# EasyEDA schematic SCH_AidF-Phone-Control-Module.json

## Sheets
1 Power Inlet: TITLE: AidF Phone Module Power and Connectors; REV: 1.0; Date: 2024-09-13; Sheet: 1/1; Drawn By: Aidan C Franits; Company: AidF Electronics
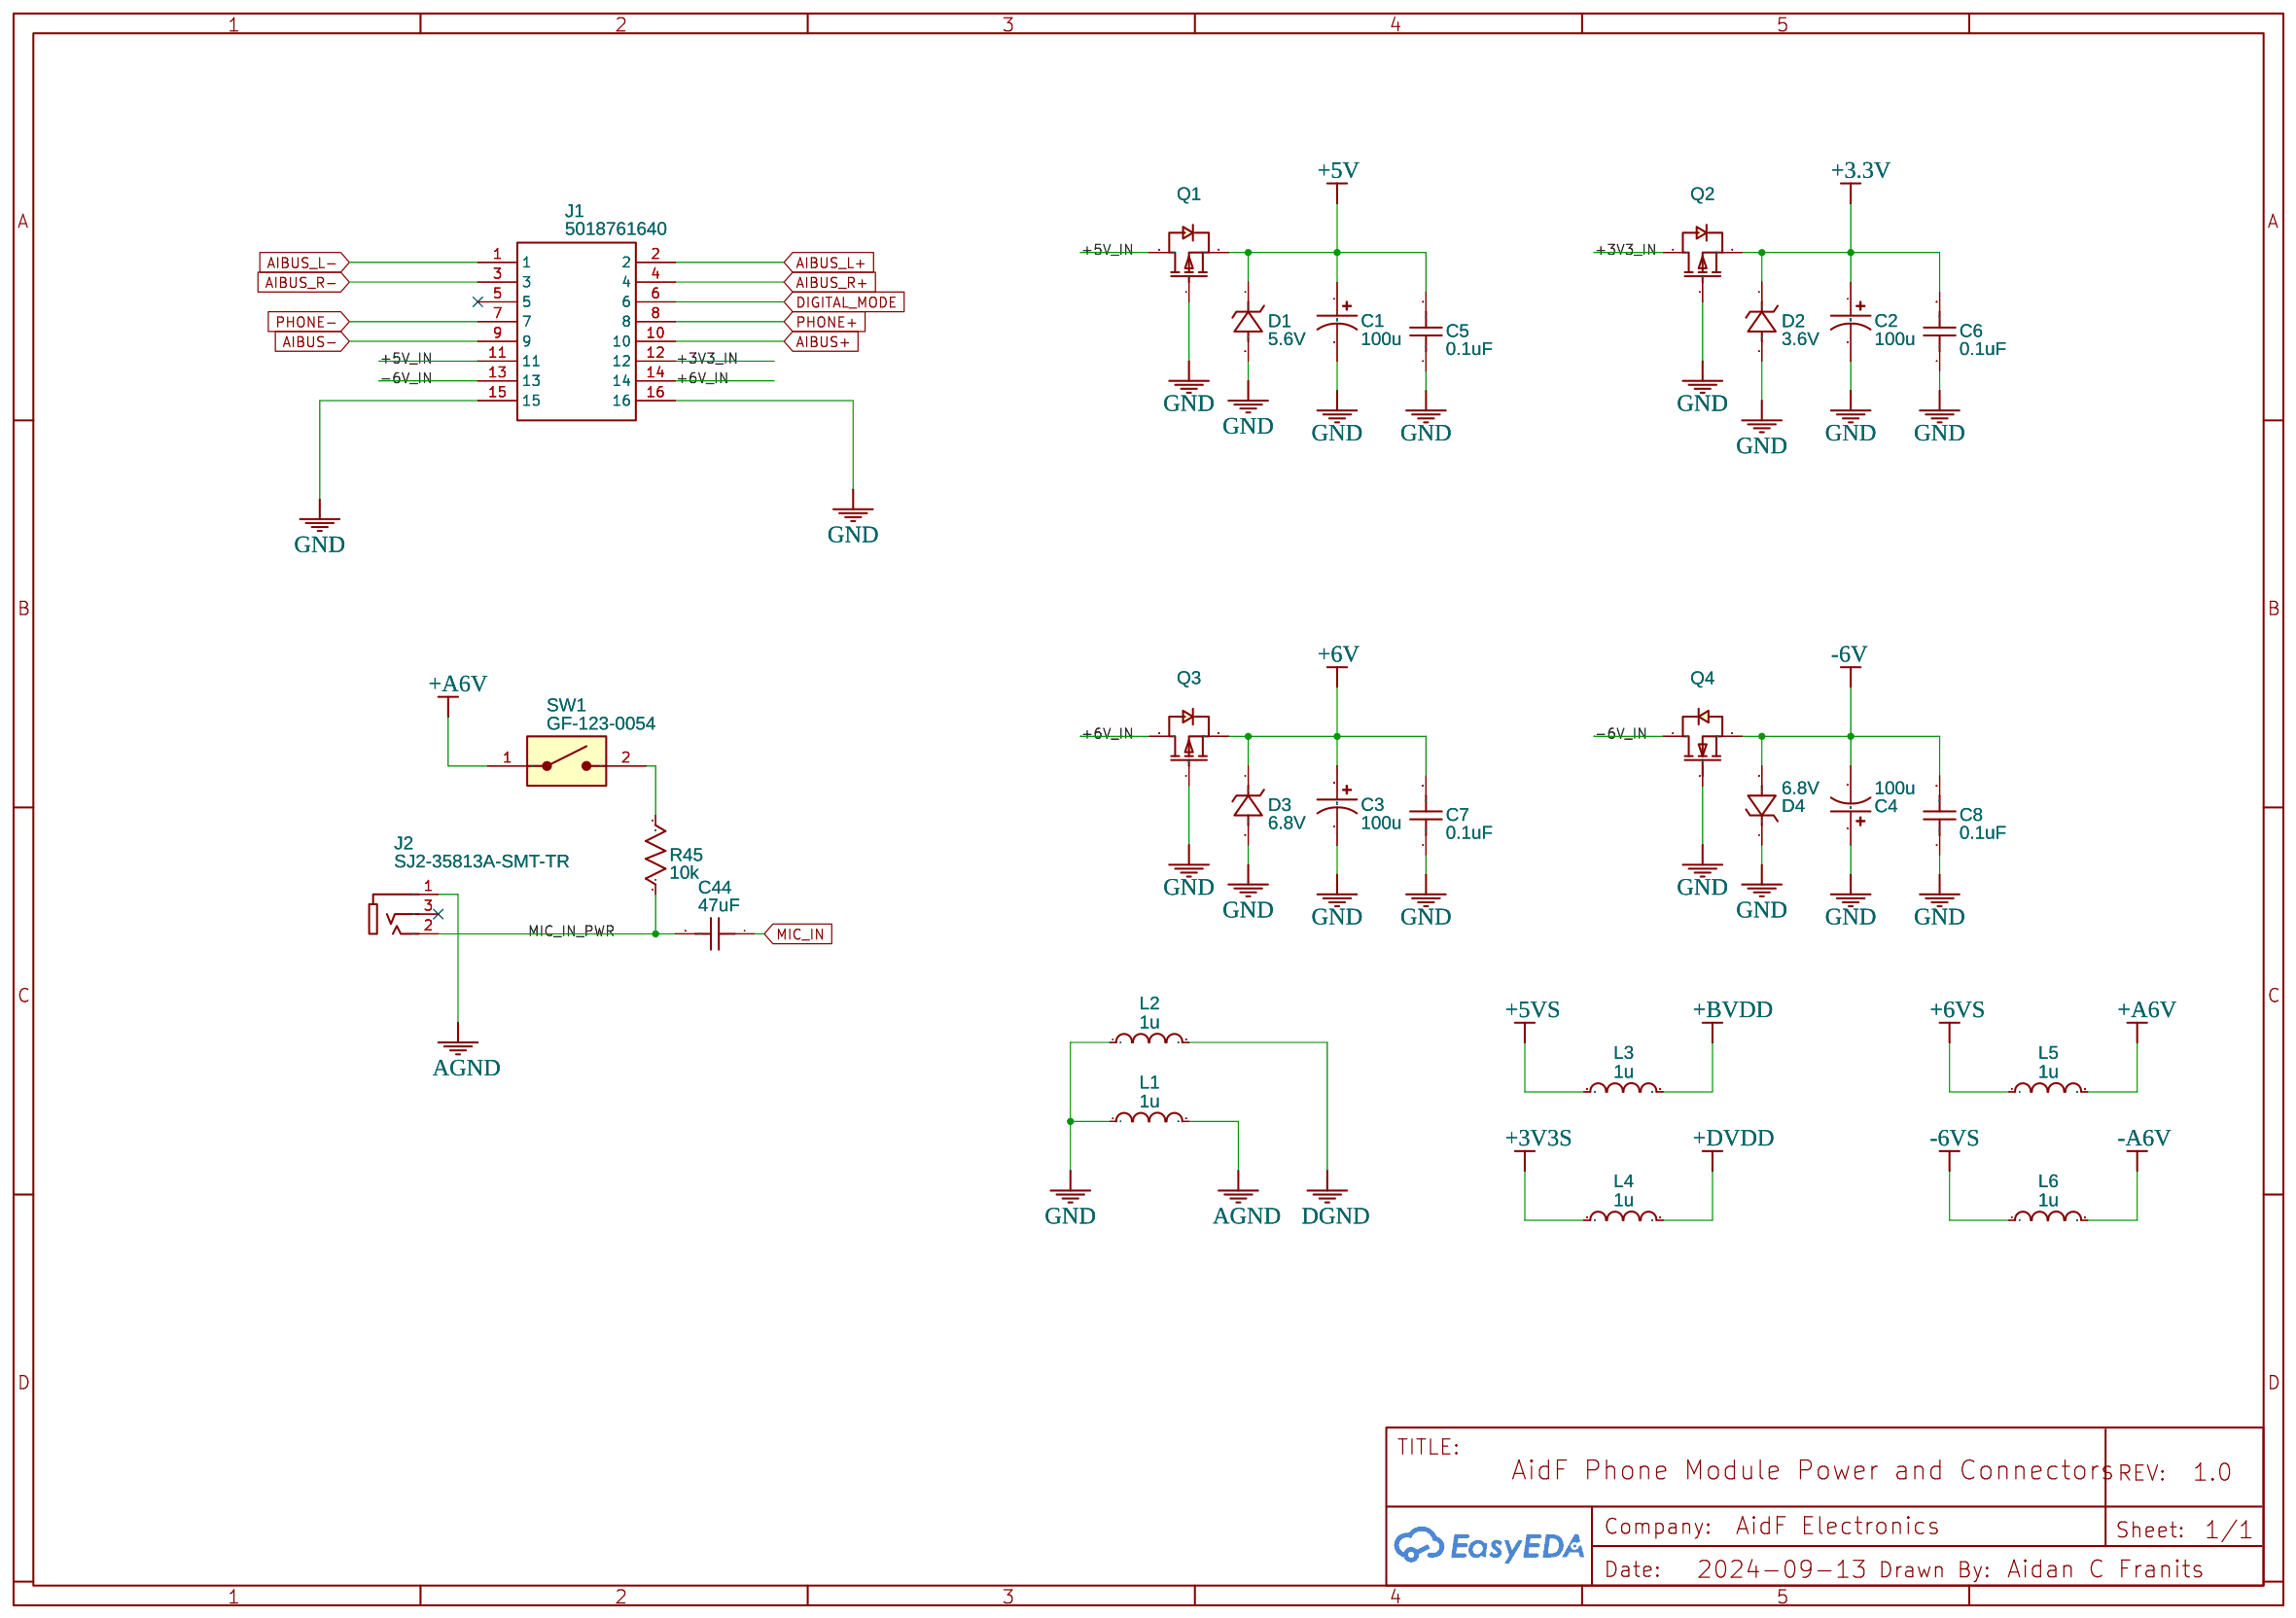
[diagram p0: Power Inlet]
2 Main Controller: TITLE: AidF Phone Control Module MCU; Date: 2024-09-14
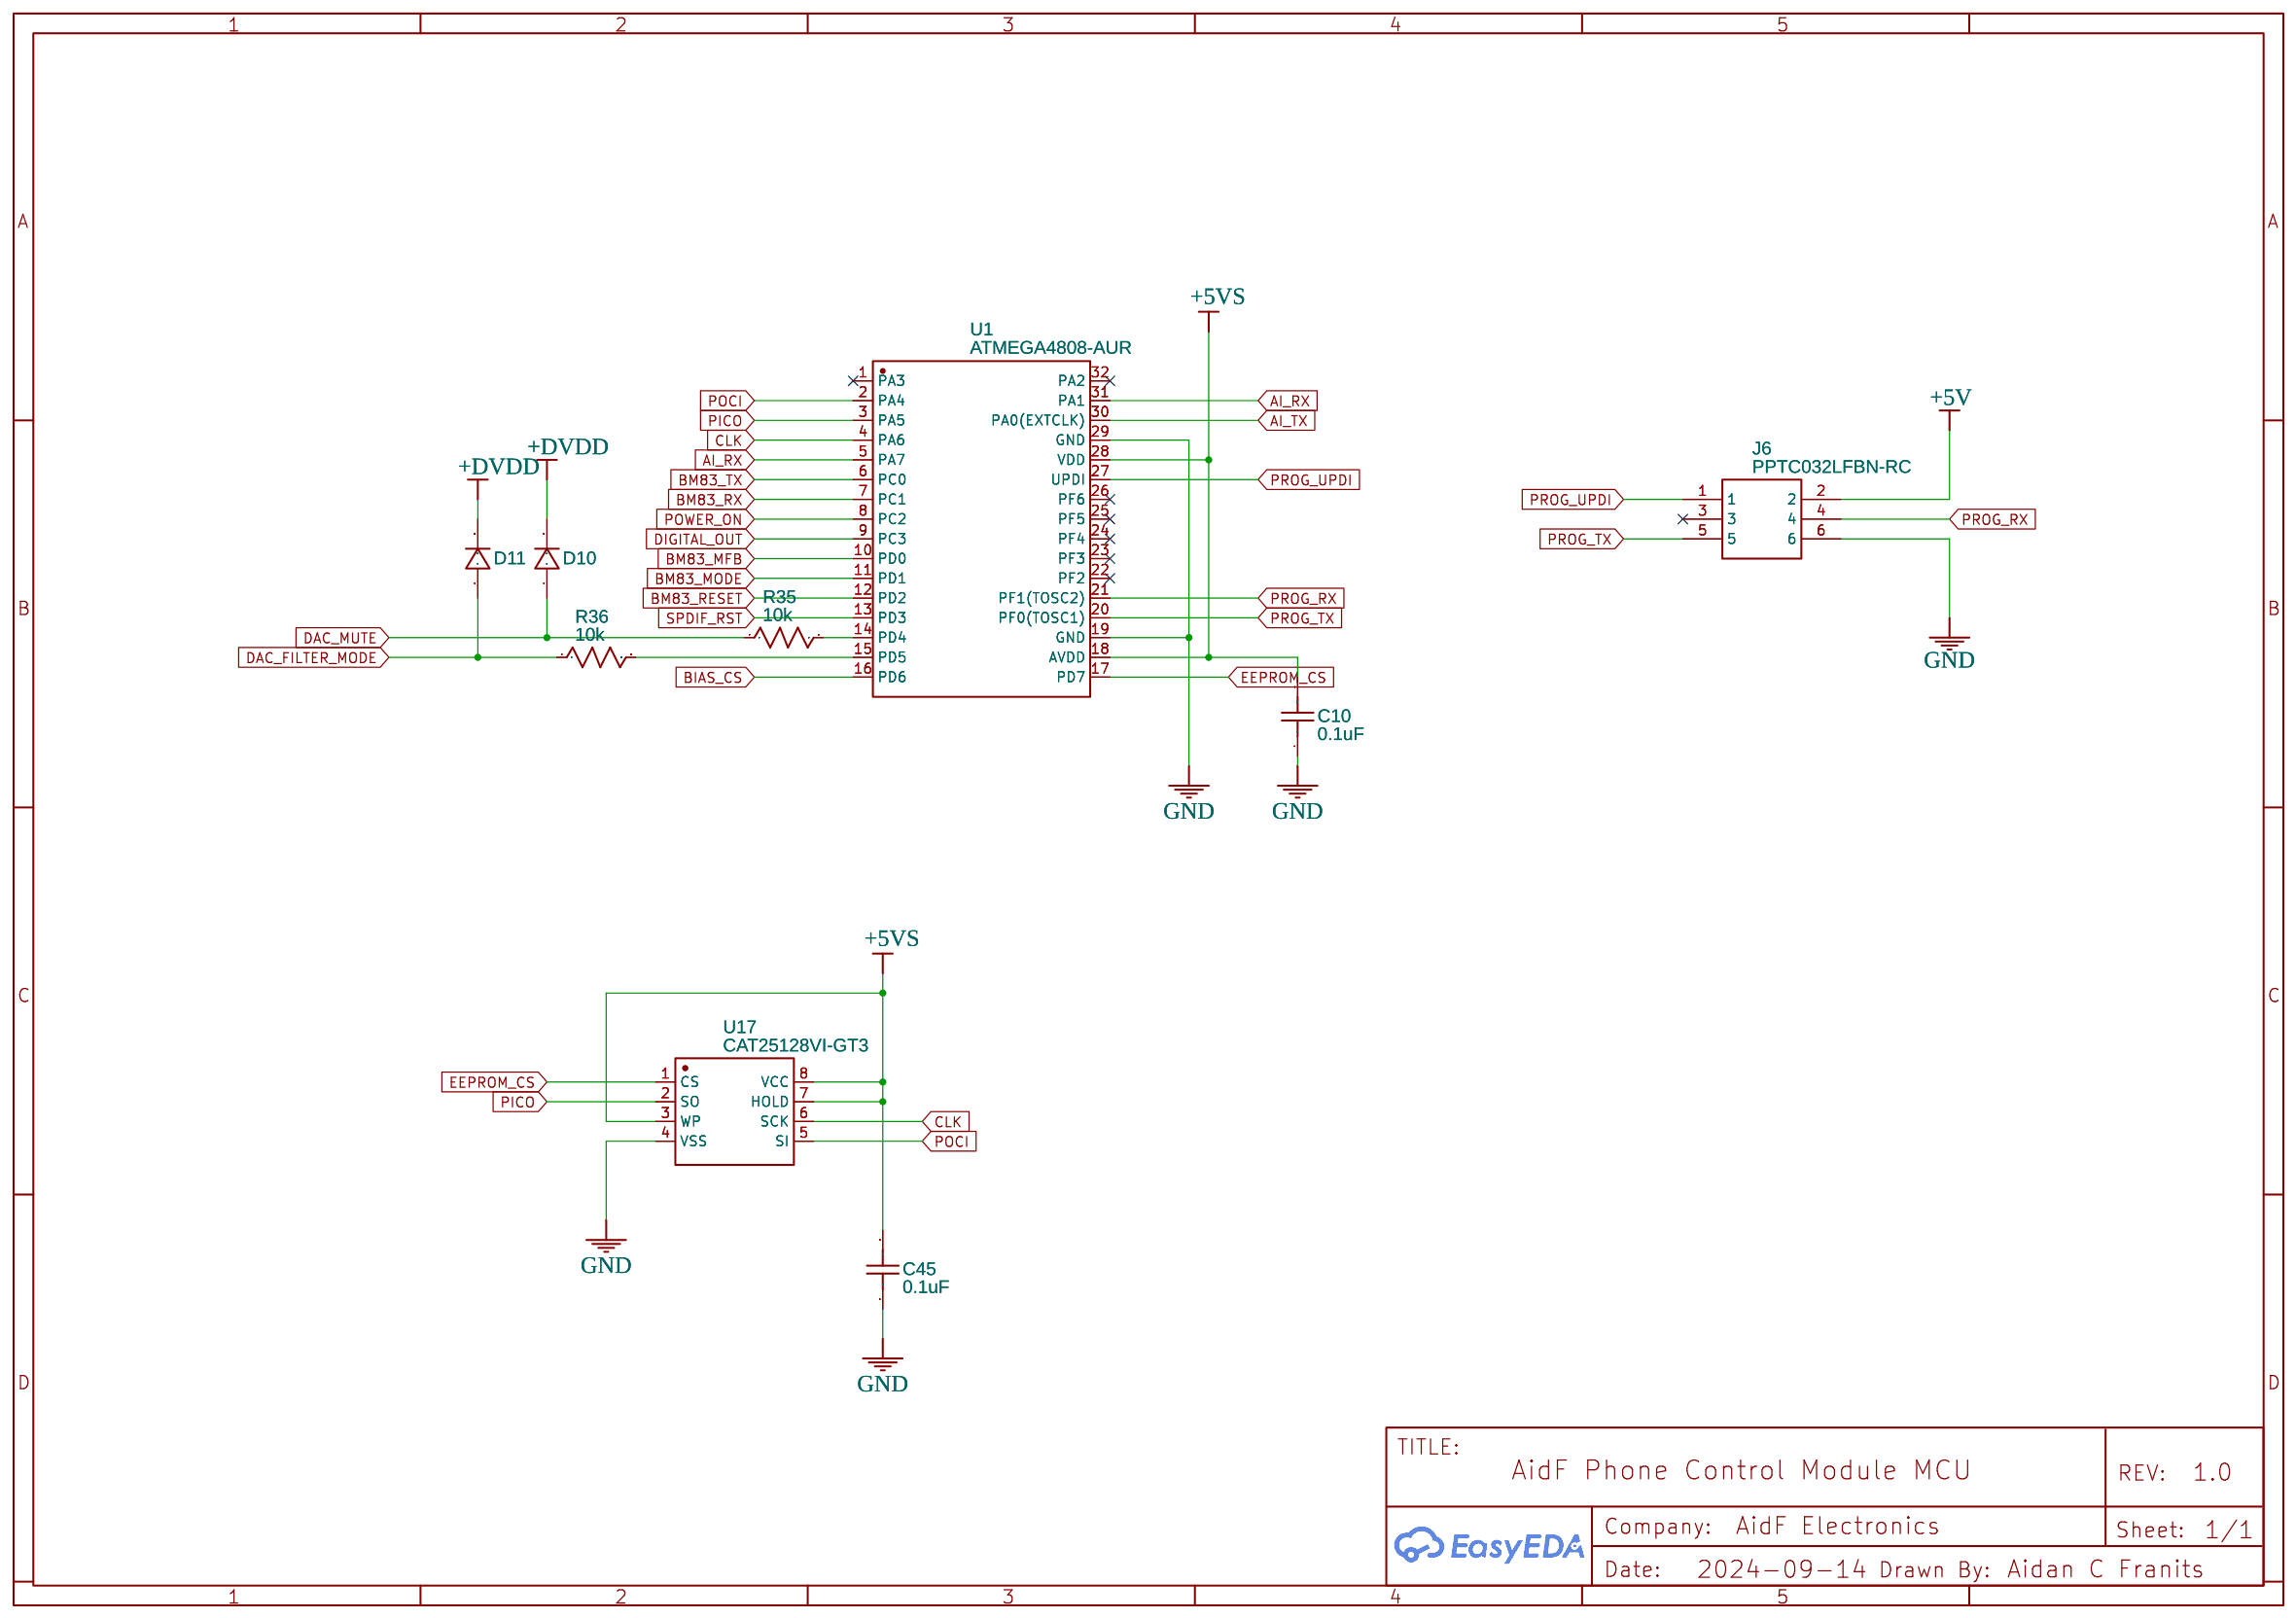
[diagram p1: Main Controller]
3 AIBus Inlet: TITLE: AidF Phone Control Module AIBus Inlet; Date: 2024-09-14
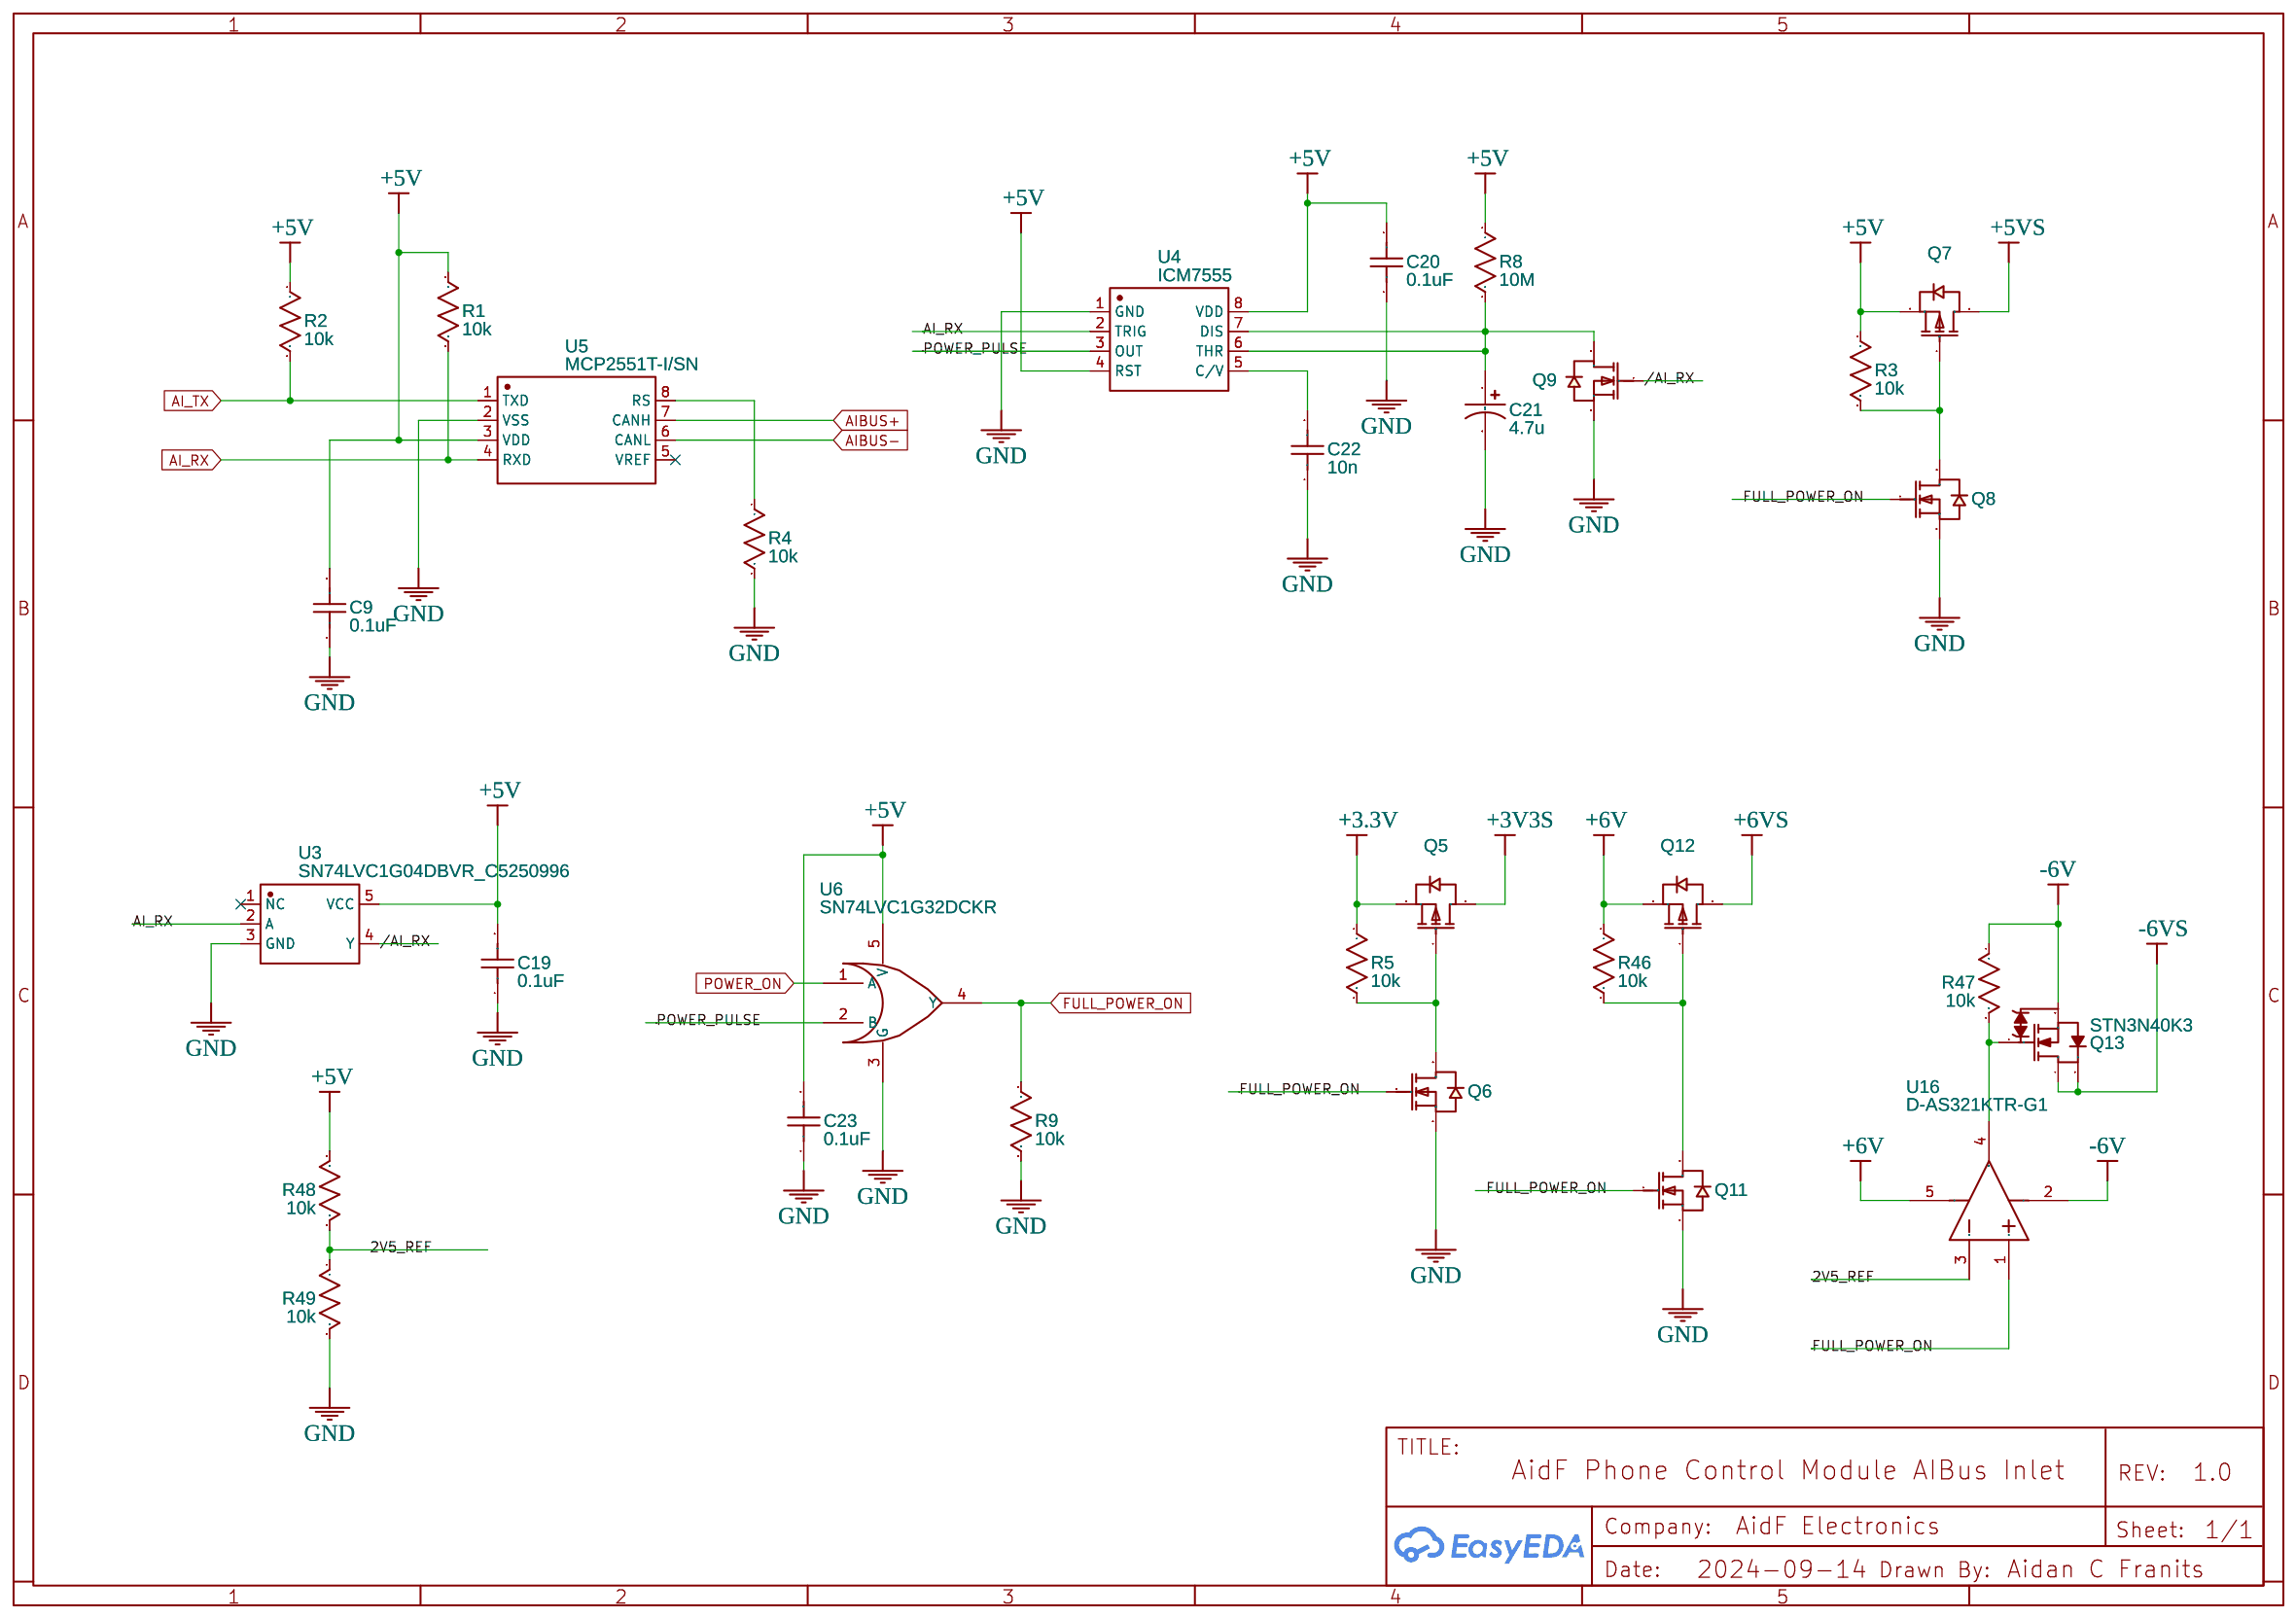
[diagram p2: AIBus Inlet]
4 BM83: TITLE: AidF Phone Control Module BM83; Date: 2024-09-14; Drawn By: A. Franits, T. Salmon
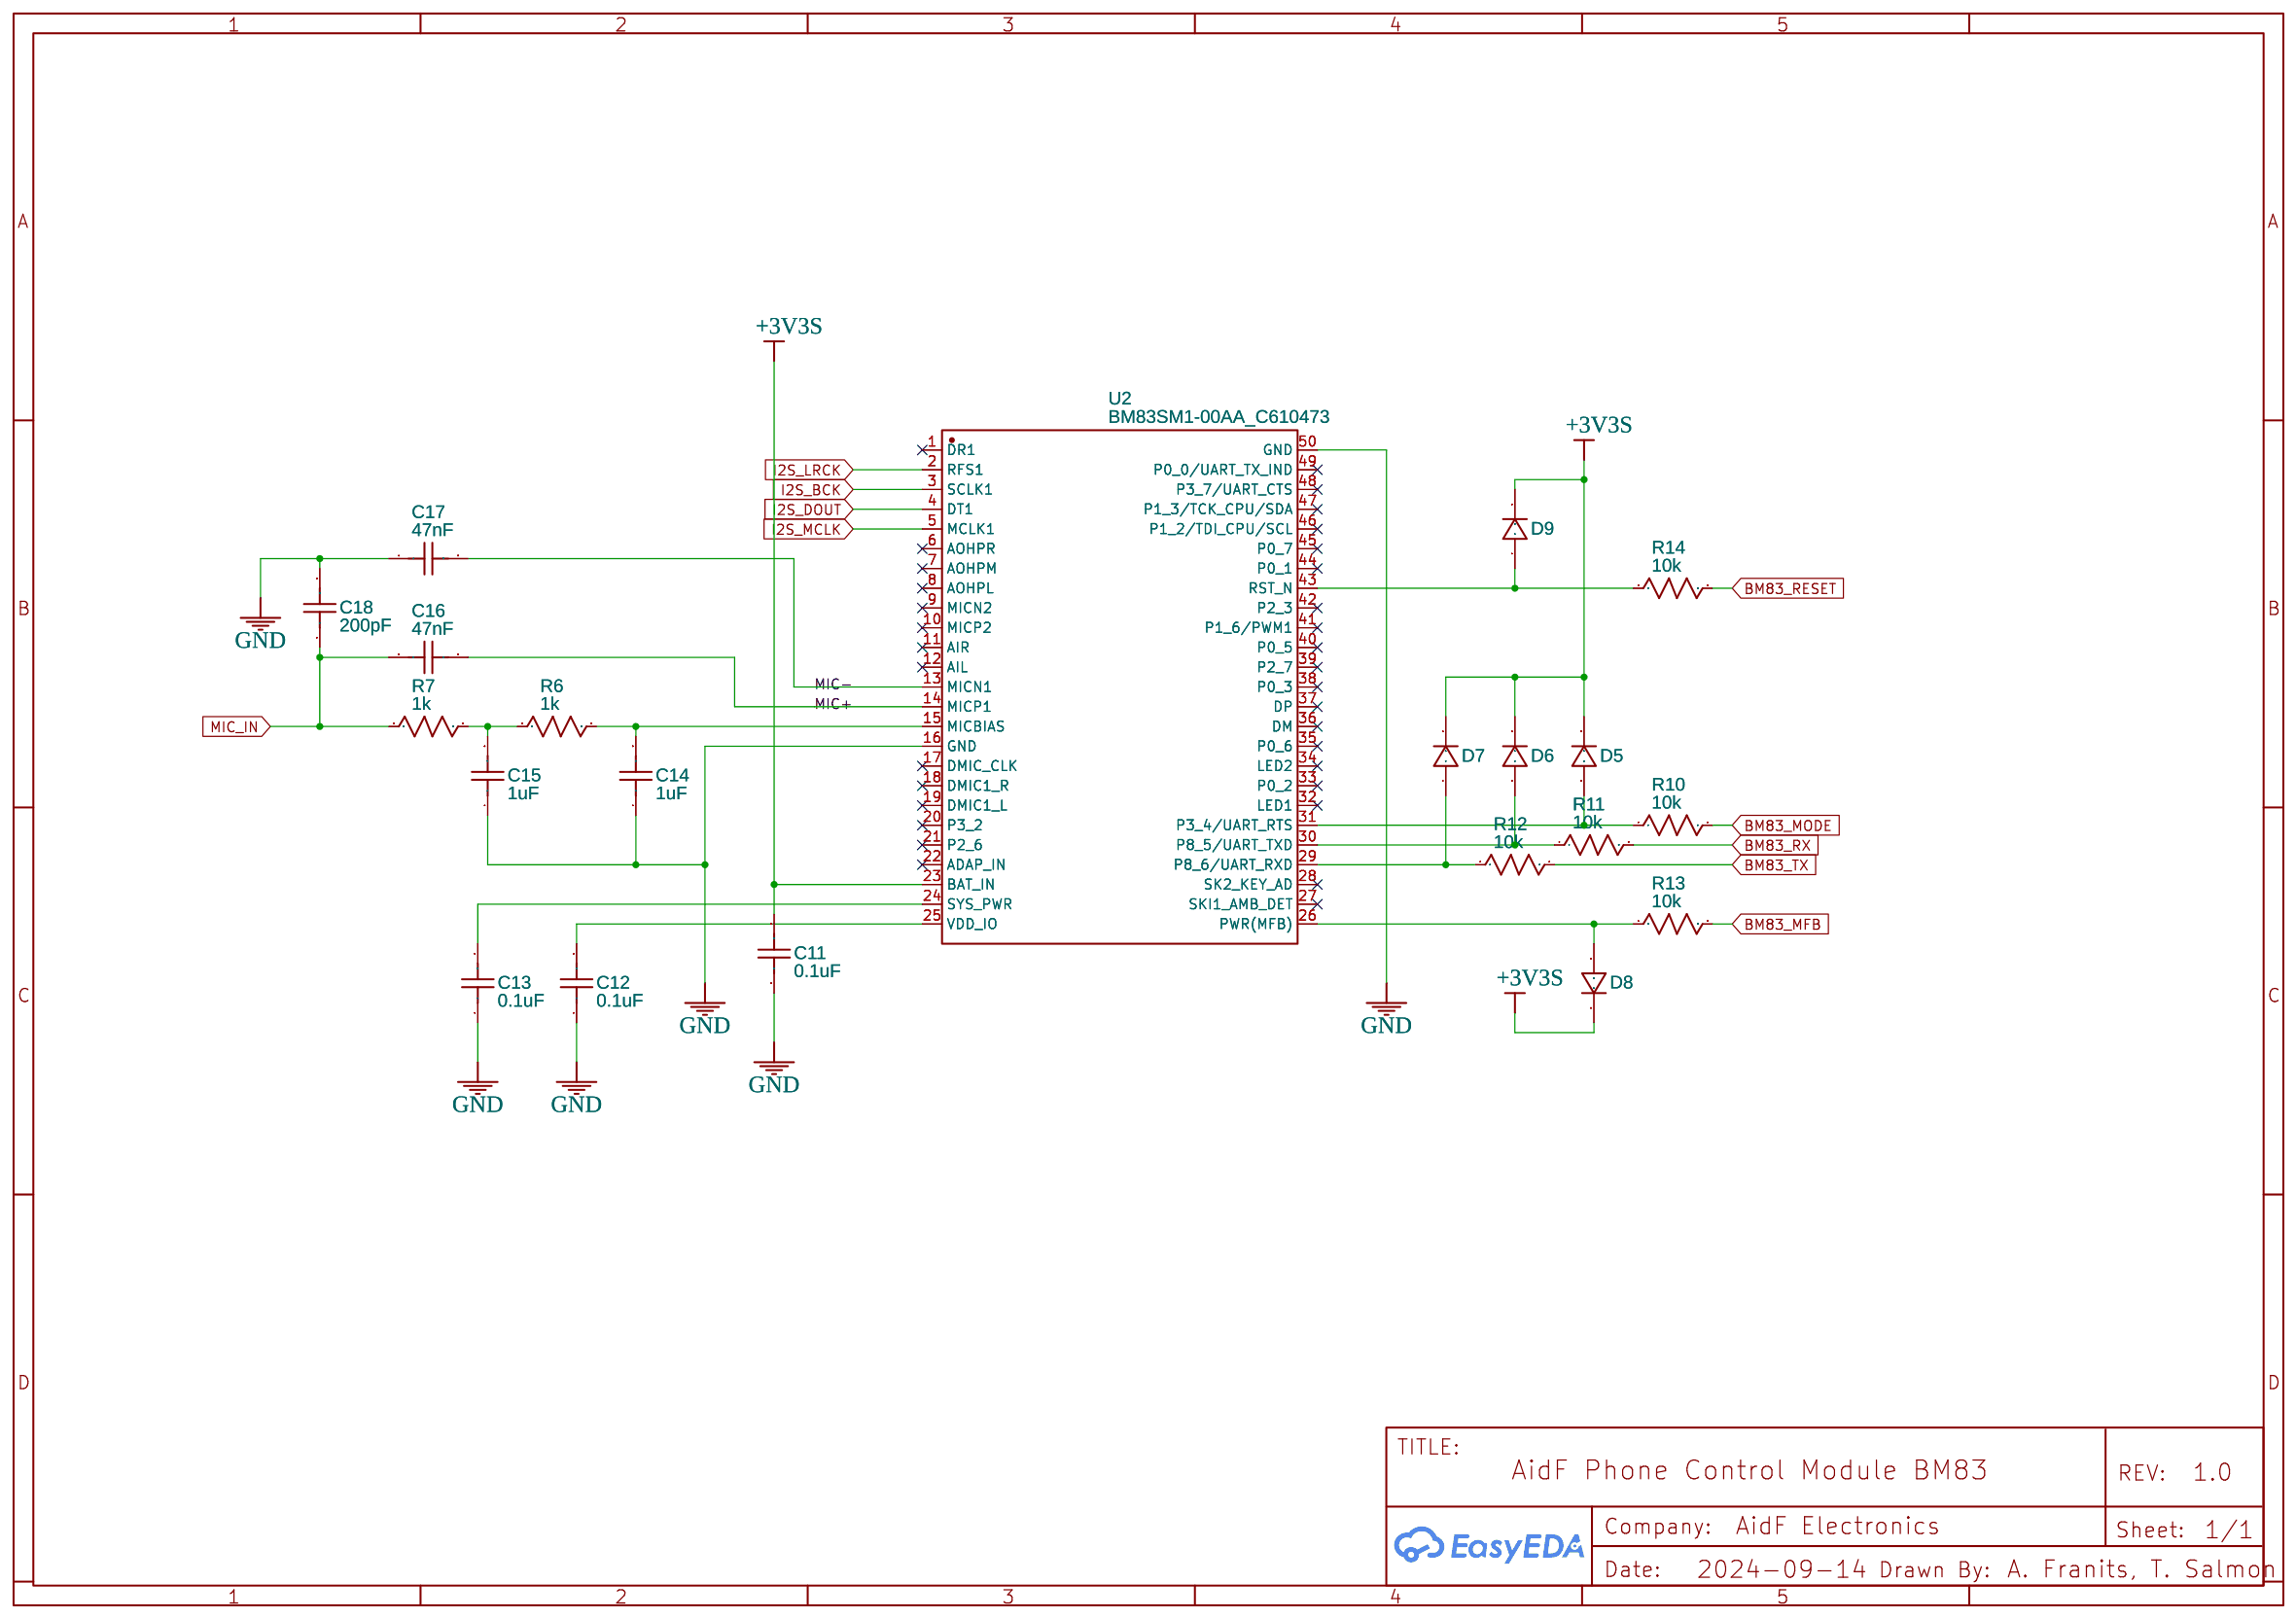
[diagram p3: BM83]
5 Digital Audio Processor: TITLE: AidF Phone Control Module DAC; Date: 2024-09-17; Drawn By: A. Franits, T. Salmon
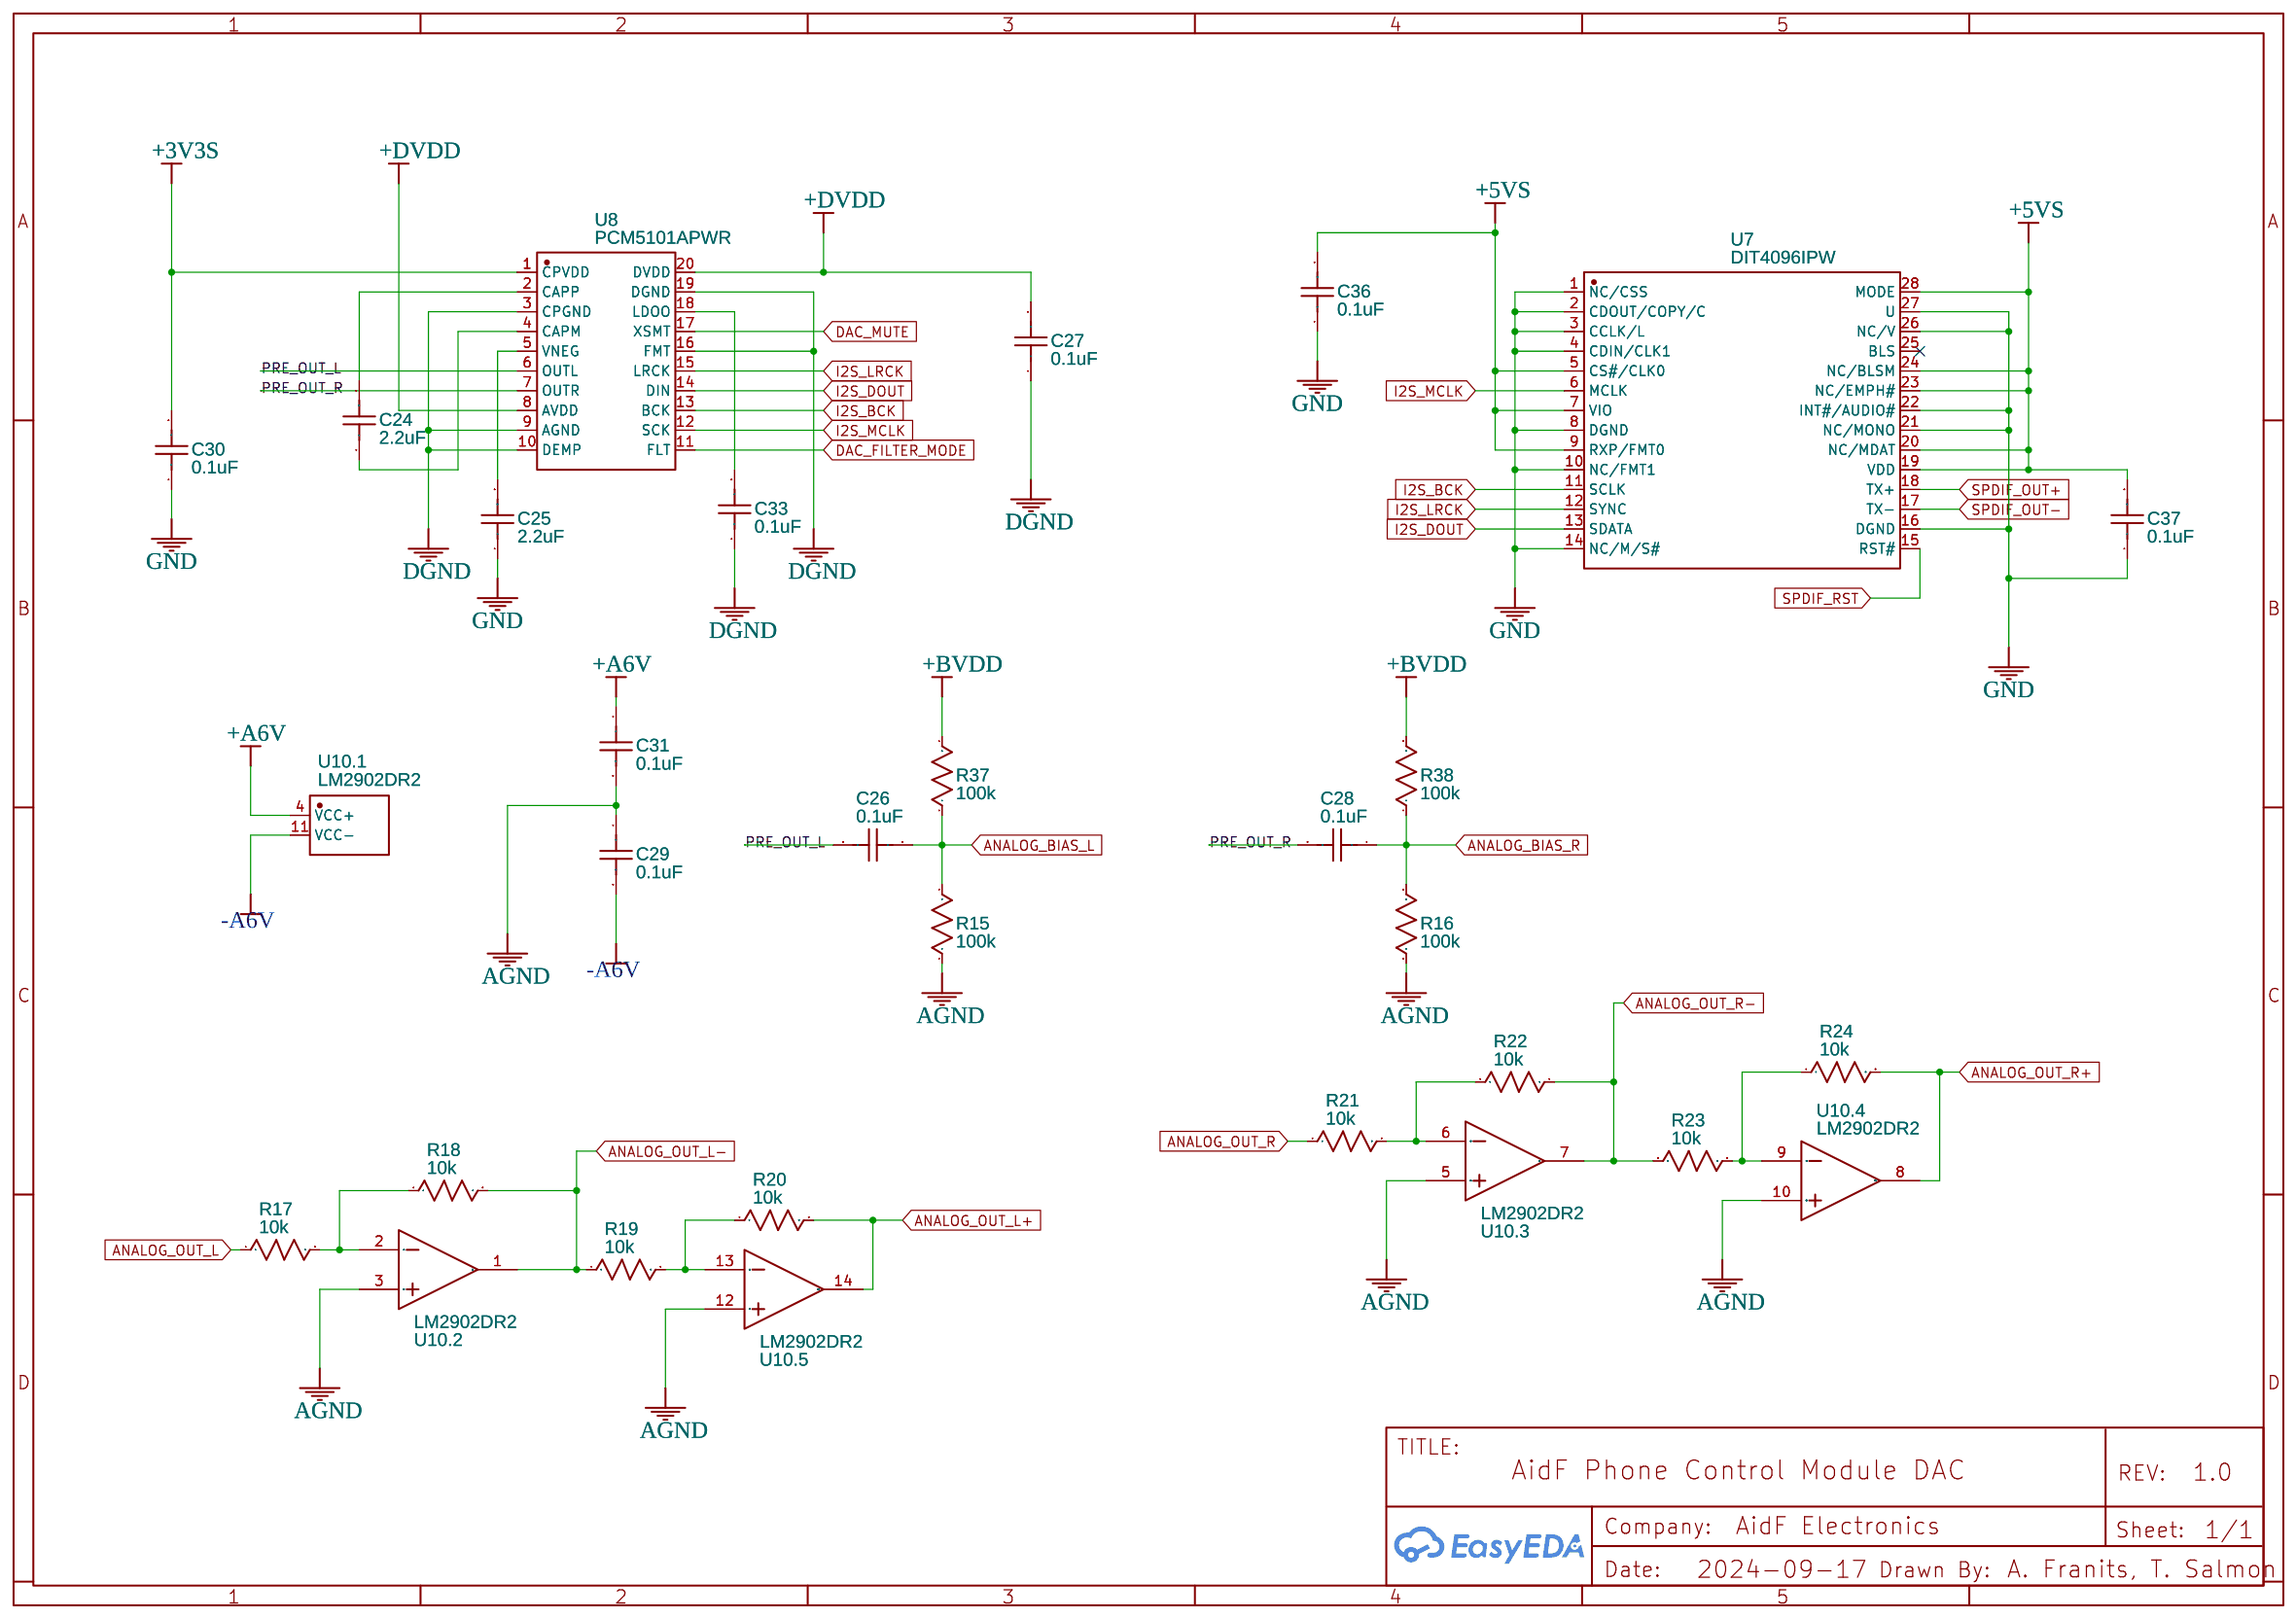
[diagram p4: Digital Audio Processor]
6 Digital Switch: TITLE: AidF Phone Control Module Switch; Date: 2024-09-17
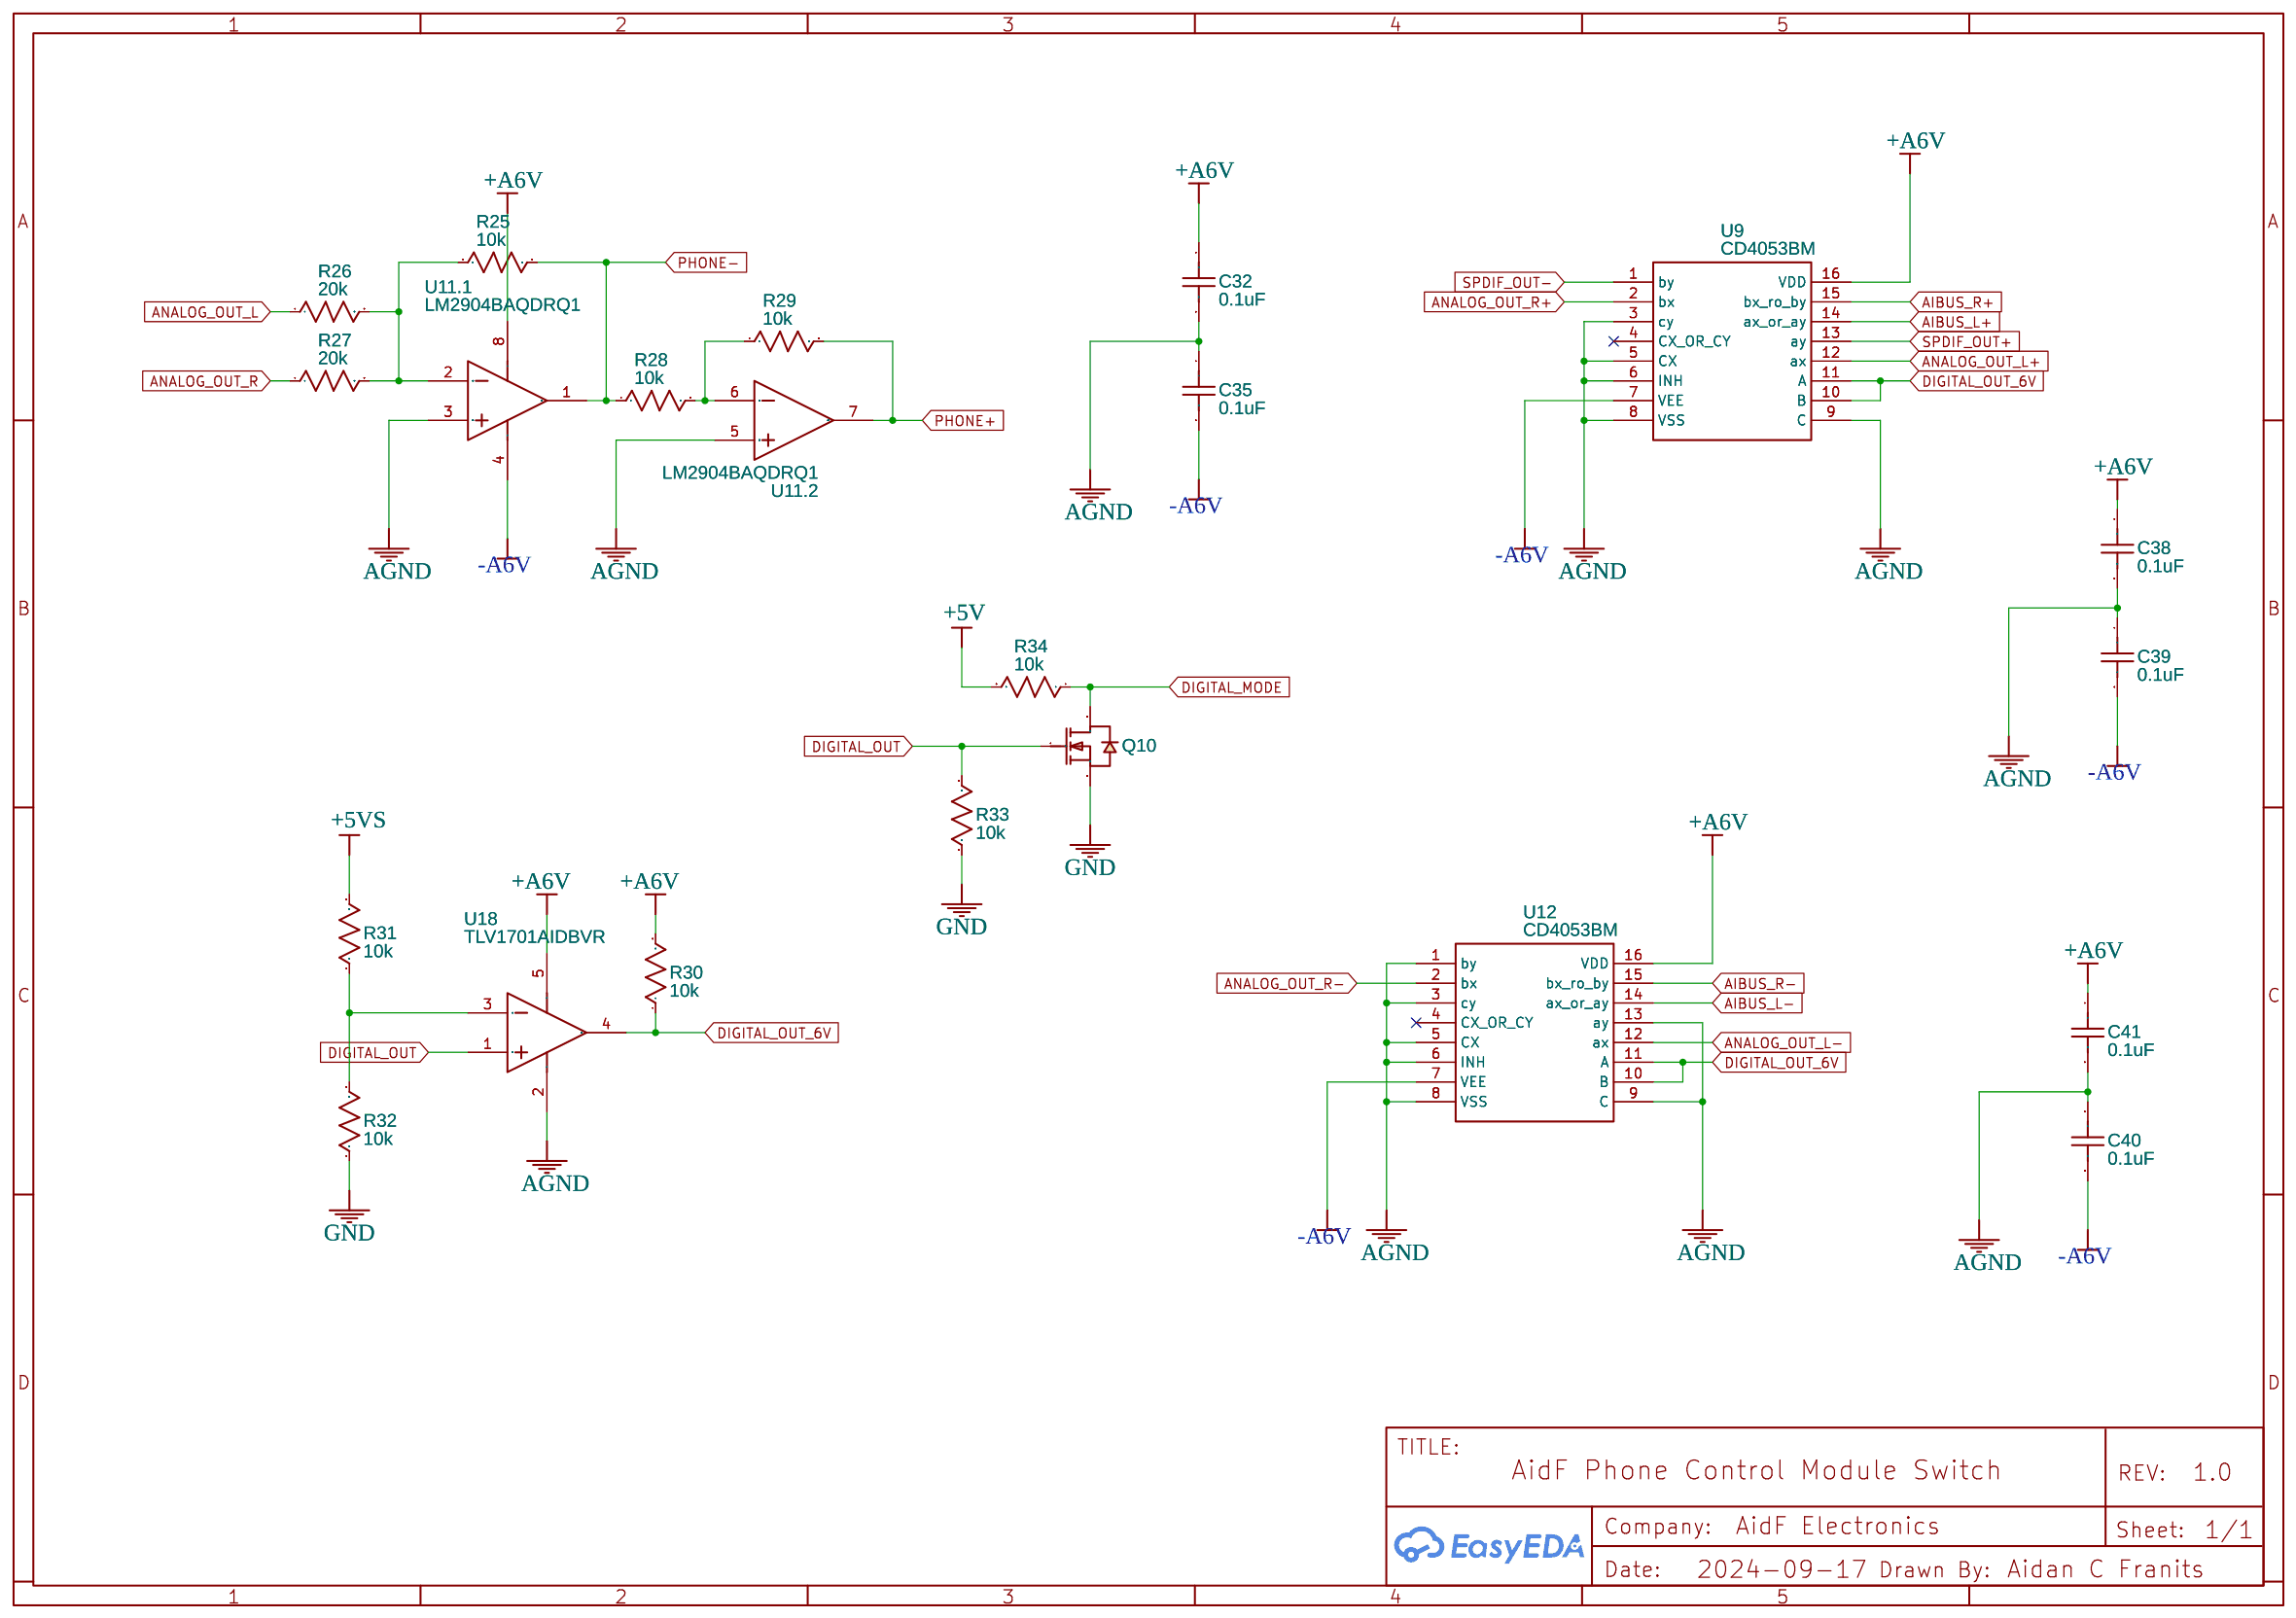
[diagram p5: Digital Switch]
7 Analog Bias: TITLE: AidF Phone Control Module Analog Bias; Date: 2024-09-20
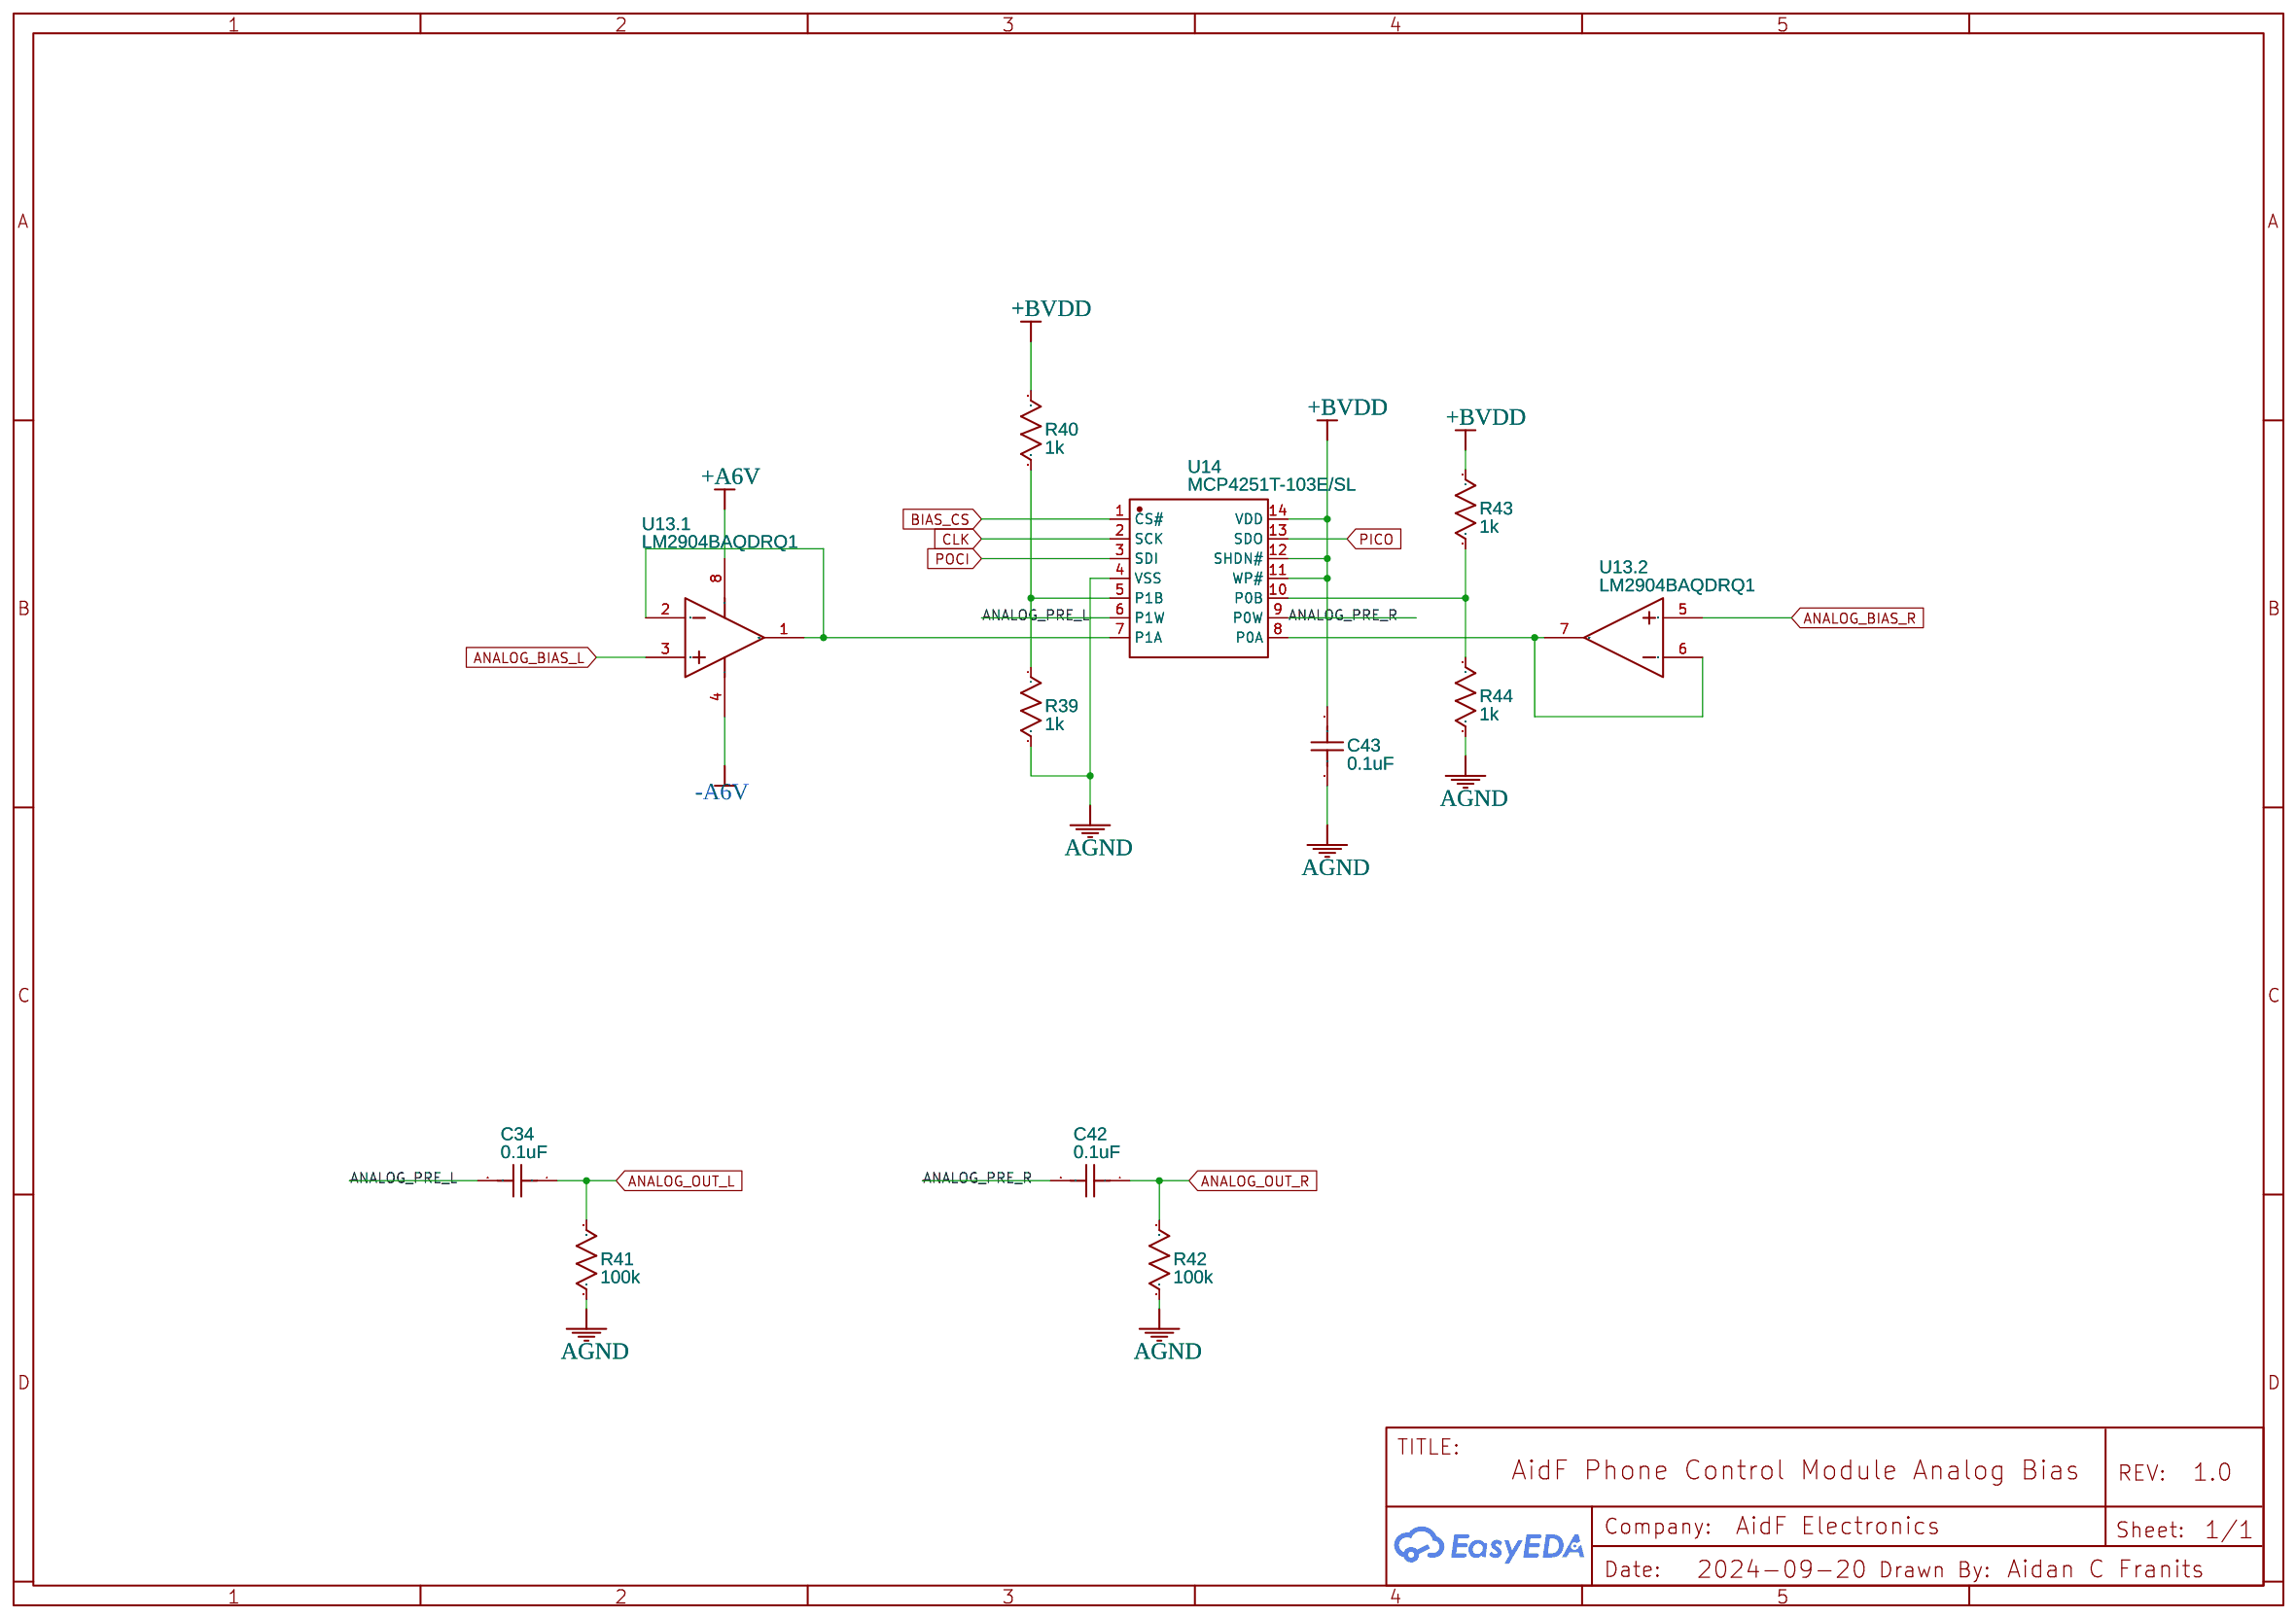
[diagram p6: Analog Bias]

## Parts
sheet AIBus Inlet
C9  0.1uF  [C0603]
C19  0.1uF  [C0603]
C20  0.1uF  [C0603]
C21  4.7u  [CAP-D5.0×F2.0]
C22  10n  [C0603]
C23  0.1uF  [C0603]
Q5  SI2347DS-T1-GE3  [SOT-23-3_L2.9-W1.3-P1.83-LS2.4-BR-1]
Q6  DMN67D8LW-13  [SOT-323-3_L2.2-W1.3-P1.30-LS2.1-BR]
Q7  SI2347DS-T1-GE3  [SOT-23-3_L2.9-W1.3-P1.83-LS2.4-BR-1]
Q8  DMN67D8LW-13  [SOT-323-3_L2.2-W1.3-P1.30-LS2.1-BR]
Q9  2N7002  [SOT-23_L2.9-W1.3-P0.95-LS2.4-BR]
Q11  DMN67D8LW-13  [SOT-323-3_L2.2-W1.3-P1.30-LS2.1-BR]
Q12  SI2347DS-T1-GE3  [SOT-23-3_L2.9-W1.3-P1.83-LS2.4-BR-1]
Q13  STN3N40K3  [SOT-223_L6.5-W3.5-P2.30-LS7.0-BR]
R1  10k  [R0603]
R2  10k  [R0603]
R3  10k  [R0603]
R4  10k  [R0603]
R5  10k  [R0603]
R8  10M  [R0603]
R9  10k  [R0603]
R46  10k  [R0603]
R47  10k  [R0603]
R48  10k  [R0603]
R49  10k  [R0603]
U3  SN74LVC1G04DBVR_C5250996  [SOT-23-5_L2.9-W1.6-P0.95-LS2.8-BR]
U4  ICM7555  [SOIC-8]
U5  MCP2551T-I/SN  [SOIC-8_L4.9-W3.9-P1.27-LS6.0-BL-2]
U6  SN74LVC1G32DCKR  [SC-70-5_L2.1-W1.3-P0.65-LS2.1-BL]
U16  D-AS321KTR-G1  [SOT-23-5_L2.9-W1.6-P0.95-LS2.8-BL]
sheet Analog Bias
C34  0.1uF  [C0603]
C42  0.1uF  [C0603]
C43  0.1uF  [C0603]
R39  1k  [R0603]
R40  1k  [R0603]
R41  100k  [R0603]
R42  100k  [R0603]
R43  1k  [R0603]
R44  1k  [R0603]
U13  LM2904BAQDRQ1  [SOIC-8_L4.9-W3.9-P1.27-LS6.0-BL]  (sections 1,2)
U14  MCP4251T-103E/SL  [SOIC-14_L8.7-W3.9-P1.27-LS6.0-BL]
sheet BM83
C11  0.1uF  [C0603]
C12  0.1uF  [C0603]
C13  0.1uF  [C0603]
C14  1uF  [C0603]
C15  1uF  [C0603]
C16  47nF  [C0603]
C17  47nF  [C0603]
C18  200pF  [C0603]
D5  SD103AWS-TP  [SOD-323_L1.8-W1.3-LS2.6-FD]
D6  SD103AWS-TP  [SOD-323_L1.8-W1.3-LS2.6-FD]
D7  SD103AWS-TP  [SOD-323_L1.8-W1.3-LS2.6-FD]
D8  SD103AWS-TP  [SOD-323_L1.8-W1.3-LS2.6-FD]
D9  SD103AWS-TP  [SOD-323_L1.8-W1.3-LS2.6-FD]
R6  1k  [R0603]
R7  1k  [R0603]
R10  10k  [R0603]
R11  10k  [R0603]
R12  10k  [R0603]
R13  10k  [R0603]
R14  10k  [R0603]
U2  BM83SM1-00AA_C610473  [COMM-SMD_BM83SM1]
sheet Digital Audio Processor
C24  2.2uF  [C0603]
C25  2.2uF  [C0603]
C26  0.1uF  [C0603]
C27  0.1uF  [C0603]
C28  0.1uF  [C0603]
C29  0.1uF  [C0603]
C30  0.1uF  [C0603]
C31  0.1uF  [C0603]
C33  0.1uF  [C0603]
C36  0.1uF  [C0603]
C37  0.1uF  [C0603]
R15  100k  [R0603]
R16  100k  [R0603]
R17  10k  [R0603]
R18  10k  [R0603]
R19  10k  [R0603]
R20  10k  [R0603]
R21  10k  [R0603]
R22  10k  [R0603]
R23  10k  [R0603]
R24  10k  [R0603]
R37  100k  [R0603]
R38  100k  [R0603]
U7  DIT4096IPW  [TSSOP-28_L9.7-W4.4-P0.65-LS6.4-BL]
U8  PCM5101APWR  [TSSOP-20_L6.5-W4.4-P0.65-LS6.5-BL]
U10  LM2902DR2  [SOIC-14_L8.7-W3.9-P1.27-LS6.0-BL]  (sections 1,2,3,4,5)
sheet Digital Switch
C32  0.1uF  [C0603]
C35  0.1uF  [C0603]
C38  0.1uF  [C0603]
C39  0.1uF  [C0603]
C40  0.1uF  [C0603]
C41  0.1uF  [C0603]
Q10  DMN67D8LW-13  [SOT-323-3_L2.2-W1.3-P1.30-LS2.1-BR]
R25  10k  [R0603]
R26  20k  [R0603]
R27  20k  [R0603]
R28  10k  [R0603]
R29  10k  [R0603]
R30  10k  [R0603]
R31  10k  [R0603]
R32  10k  [R0603]
R33  10k  [R0603]
R34  10k  [R0603]
U9  CD4053BM  [SOIC-16_L9.9-W3.9-P1.27-LS6.0-BL]
U11  LM2904BAQDRQ1  [SOIC-8_L4.9-W3.9-P1.27-LS6.0-BL]  (sections 1,2)
U12  CD4053BM  [SOIC-16_L9.9-W3.9-P1.27-LS6.0-BL]
U18  TLV1701AIDBVR  [SOT-23-5_L3.0-W1.7-P0.95-LS2.8-BR]
sheet Main Controller
C10  0.1uF  [C0603]
C45  0.1uF  [C0603]
D10  SD103AWS-TP  [SOD-323_L1.8-W1.3-LS2.6-FD]
D11  SD103AWS-TP  [SOD-323_L1.8-W1.3-LS2.6-FD]
J6  PPTC032LFBN-RC  [RHDR6W75P254_2X3_812X508X850P]
R35  10k  [R0603]
R36  10k  [R0603]
U1  ATMEGA4808-AUR  [TQFP-32_L7.0-W7.0-P0.80-LS9.0-BL]
U17  CAT25128VI-GT3  [SOIC-8]
sheet Power Inlet
C1  100u  [CAP-D6.3×F2.5]
C2  100u  [CAP-D6.3×F2.5]
C3  100u  [CAP-D6.3×F2.5]
C4  100u  [CAP-D6.3×F2.5]
C5  0.1uF  [C0603]
C6  0.1uF  [C0603]
C7  0.1uF  [C0603]
C8  0.1uF  [C0603]
C44  47uF  [C1210]
D1  5.6V  [SOD-123_L2.7-W1.6-LS3.7-RD-A]
D2  3.6V  [SOD-123_L2.7-W1.6-LS3.7-RD-A]
D3  6.8V  [SOD-123_L2.7-W1.6-LS3.7-RD-A]
D4  6.8V  [SOD-123_L2.7-W1.6-LS3.7-RD-A]
J1  5018761640  [CONN-TH_5018761640]
J2  SJ2-35813A-SMT-TR  [AUDIO-SMD_SJ2-35813A-SMT-TR]
L1  1u  [L0603]
L2  1u  [L0603]
L3  1u  [L0603]
L4  1u  [L0603]
L5  1u  [L0603]
L6  1u  [L0603]
Q1  SI2347DS-T1-GE3  [SOT-23-3_L2.9-W1.3-P1.83-LS2.4-BR-1]
Q2  SI2347DS-T1-GE3  [SOT-23-3_L2.9-W1.3-P1.83-LS2.4-BR-1]
Q3  SI2347DS-T1-GE3  [SOT-23-3_L2.9-W1.3-P1.83-LS2.4-BR-1]
Q4  2N7002  [SOT-23_L2.9-W1.3-P0.95-LS2.4-BR]
R45  10k  [R0603]
SW1  GF-123-0054  [GF-123-0054]

## Library data of the parts
C5-C13 C19 C20 C23 C26-C45 = C_0603_US: Supplier Part: 1292-1392-1-ND; Supplier: Digi-Key; Contributor: LCEDA_Lib; Manufacturer Part: 0603B104K101CT; Manufacturer: Walsin Technology Corporation
C21 = CE_TH_D5.0×F2.0_US: Supplier Part: 732-8818-1-ND; Supplier: Digi-Key; Contributor: LCEDA_Lib; Manufacturer Part: 860020472001; Manufacturer: Würth Elektronik
C22 = C_0603_US: Supplier Part: 490-4781-1-ND; Supplier: Digi-Key; Contributor: LCEDA_Lib; Manufacturer Part: GCM188R72A103KA37D; Manufacturer: Murata Electronics
Q1-Q3 Q5 Q7 Q12 = IRF5210: Supplier: Digi-Key; Manufacturer: Vishay Siliconix; Supplier Part: SI2347DS-T1-GE3CT-ND; Contributor: LCEDA_Lib
Q6 Q8 Q10 Q11 = 2N7002: Supplier: Digi-Key; Manufacturer: Diodes Incorporated; Supplier Part: DMN67D8LW-13DICT-ND; Contributor: LCEDA_Lib
Q4 Q9 = 2N7002: Supplier: Digi-Key; Manufacturer: Diodes Incorporated; Manufacturer Part: DMN3404L-7; image: //image.lceda.cn/szlcsc/C65189.jpg; Supplier Part: DMN3404LDICT-ND; Paste Type: expand; Contributor: LCEDA_Lib
Q13 = STN3N40K3: Contributor: LCSC; Supplier: Digi-Key; Supplier Part: 497-11222-1-ND; Manufacturer: STMicroelectronics; JLCPCB Part Class: Extended Part
R1-R5 R9-R14 R17-R25 R28-R36 R45-R49 = R_0603_US: Supplier Part: RNCP0603FTD10K0CT-ND; Supplier: Digi-Key; Contributor: LCEDA_Lib; Manufacturer Part: RNCP0603FTD10K0; Manufacturer: Stackpole Electronics Inc
R8 = R_0603_US: Supplier Part: RMCF0603FT10M0CT-ND; Supplier: Digi-Key; Contributor: LCEDA_Lib; Manufacturer Part: RMCF0603FT10M0; Manufacturer: Stackpole Electronics Inc
U3 = SN74LVC1G04DBVR_C5250996: Supplier: Digi-Key; Supplier Part: 296-11599-1-ND; Manufacturer: Texas Instruments; Manufacturer Part: SN74LVC1G04DBVR; JLCPCB Part Class: Extended Part; Contributor: lcsc
U4 = ICM7555: Contributor: jonny0811; Manufacturer Part: ICM7555IBAZ-T; Supplier: Digi-Key; Supplier Part: ICM7555IBAZ-TCT-ND; Manufacturer: Renesas Electronics Corporation
U5 = MCP2551T-I/SN: Supplier: Digi-Key; Manufacturer: Microchip Technology; Manufacturer Part: MCP2551-I/SN; Supplier Part: MCP2551-I/SN-ND; JLCPCB Part Class: Extended Part
U6 = SN74LVC1G32DCKR: Manufacturer: Texas Instruments; Supplier Part: 296-9848-1-ND; Supplier: Digi-Key; Contributor: seabo2002
U16 = D-AS321KTR-G1: Contributor: lcsc; Supplier: Digi-Key; Supplier Part: AS321KTR-G1DICT-ND; Manufacturer: Diodes Incorporated; Manufacturer Part: AS321KTR-G1; JLCPCB Part Class: Extended Part
R6 R7 R39 R40 R43 R44 = R_0603_US: Supplier Part: 311-1.00KHRCT-ND; Supplier: Digi-Key; Contributor: LCEDA_Lib; Manufacturer Part: RC0603FR-071KL; Manufacturer: YAGEO
R15 R16 R37 R38 R41 R42 = R_0603_US: Supplier Part: 311-100KHRCT-ND; Supplier: Digi-Key; Contributor: LCEDA_Lib; Manufacturer Part: RC0603FR-07100KL; Manufacturer: YAGEO
U11 U13 = LM2904BAQDRQ1: subpart_no: 1; Supplier: Digi-Key; Supplier Part: 296-LM2904BIDRCT-ND; Manufacturer: Texas Instruments; Manufacturer Part: LM2904BIDR; JLCPCB Part Class: Extended Part
U14 = MCP4251T-103E/SL: Contributor: lcsc; Supplier: Digi-Key; Supplier Part: MCP4251T-103E/SLCT-ND; Manufacturer: Microchip Technology; JLCPCB Part Class: Extended Part
C14 C15 = C_0603_US: Supplier Part: 311-1445-1-ND; Supplier: Digi-Key; Contributor: LCEDA_Lib; Manufacturer Part: CC0603KRX5R8BB105; Manufacturer: YAGEO
C16 C17 = C_0603_US: Supplier Part: 490-5854-1-ND; Supplier: Digi-Key; Contributor: LCEDA_Lib; Manufacturer Part: GCJ188R71H473KA12D; Manufacturer: Murata Electronics
C18 = C_0603_US: Supplier Part: 1276-2222-1-ND; Supplier: Digi-Key; Contributor: LCEDA_Lib; Manufacturer Part: CL10C201JB8NNNC; Manufacturer: Samsung Electro-Mechanics
D5-D11 = 1N4148: Supplier: Digi-Key; Supplier Part: SD103AWSTPMSCT-ND; Manufacturer: Micro Commercial Co; Contributor: LCSC
U2 = BM83SM1-00AA_C610473: Contributor: LCSC; Supplier: Digi-Key; Supplier Part: 150-BM83SM1-00AA-ND; Manufacturer: Microchip Technology; Manufacturer Part: BM83SM1-00AA; JLCPCB Part Class: Extended Part
C24 C25 = C_0603_US: Supplier Part: 490-10731-1-ND; Supplier: Digi-Key; Contributor: LCEDA_Lib; Manufacturer Part: GRM188R61E225KA12D; Manufacturer: Murata Electronics
U7 = DIT4096IPW: Contributor: lcsc; Supplier: Digi-Key; Supplier Part: DIT4096IPW-ND; Manufacturer: Texas Instruments; JLCPCB Part Class: Extended Part
U8 = PCM5101APWR: Contributor: LCSC; Supplier: Digi-Key; Supplier Part: 296-36706-1-ND; Manufacturer: Texas Instruments; JLCPCB Part Class: Extended Part
U10 = LM2902DR2: subpart_no: 1; Supplier: Digi-Key; Supplier Part: 296-14594-1-ND; Manufacturer: Texas Instruments; Manufacturer Part: LM2902DR
R26 R27 = R_0603_US: Supplier Part: P20.0KHCT-ND; Supplier: Digi-Key; Contributor: LCEDA_Lib; Manufacturer Part: ERJ-3EKF2002V; Manufacturer: Panasonic Electronic Components
U9 U12 = CD4053BM: Contributor: LCSC; Supplier: Digi-Key; Supplier Part: 296-14274-1-ND; Manufacturer: Texas Instruments; Manufacturer Part: CD4053BM96; JLCPCB Part Class: Extended Part
U18 = TLV1701AIDBVR: Contributor: LCSC; Supplier: Digi-Key; Manufacturer: Texas Instruments; Supplier Part: 296-40599-1-ND; JLCPCB Part Class: Extended Part
J6 = PPTC032LFBN-RC: Contributor: achinya_m; Supplier: Digi-Key; Supplier Part: S7071-ND; Manufacturer: Sullins Connector Solutions
U1 = ATMEGA4808-AUR: Contributor: lcsc; Supplier: Digi-Key; Supplier Part: 150-ATMEGA4808-AURCT-ND; Manufacturer: Microchip Technology; JLCPCB Part Class: Extended Part
U17 = CAT25128VI-GT3: Manufacturer: onsemi; Supplier Part: CAT25128VI-GT3OSCT-ND; Supplier: Digi-Key
C1-C4 = CE_TH_D6.3×F2.5_US: Supplier Part: 399-6650-1-ND; Supplier: Digi-Key; Contributor: LCEDA_Lib; Manufacturer Part: ESK107M025AE3EA; Manufacturer: KEMET
D1 = BZT52C12-TP: Contributor: LCSC; Supplier: Digi-Key; Supplier Part: MMSZ5232BT1GOSCT-ND; Manufacturer: onsemi; Manufacturer Part: MMSZ5232BT1G; JLCPCB Part Class: Extended Part
D2 = BZT52C12-TP: Contributor: LCSC; Supplier: Digi-Key; Supplier Part: MMSZ4685-TPMSCT-ND; Manufacturer: Micro Commercial Co; Manufacturer Part: MMSZ4685-TP; JLCPCB Part Class: Extended Part
D3 D4 = BZT52C12-TP: Contributor: LCSC; Supplier: Digi-Key; Supplier Part: MMSZ4692T1GOSCT-ND; Manufacturer: onsemi; Manufacturer Part: MMSZ4692T1G; JLCPCB Part Class: Extended Part
J1 = 5018761640: Contributor: LCSC; Supplier: Digi-Key; Supplier Part: WM6089-ND; Manufacturer: Molex; JLCPCB Part Class: Extended Part
J2 = SJ2-35813A-SMT-TR: Supplier: Digi-Key; Supplier Part: CP-SJ2-35813A-SMT-CT-ND; Manufacturer: CUI; JLCPCB Part Class: Extended Part; Contributor: lcsc
L1-L6 = L0603_US: Supplier Part: 445-174936-1-ND; Supplier: Digi-Key; Contributor: LCEDA_Lib; Manufacturer Part: MAF1608FAD151CT000; Manufacturer: TDK Corporation
SW1 = GF-123-0054: Supplier Part: CWI333-ND; Supplier: Digi-Key; Contributor: Bram Stolk; Manufacturer: CW Industries; link: https://media.digikey.com/pdf/Data%20Sheets/CW%20Industries%20PDFs/GF-123-0054_Dwg.pdf

## Nets
2V5_REF: R48.2 R49.1 U16.3(-IN)
+3.3V: C2.1 C6.2 D2.1(K) Q2.2(S) Q5.2(S) R5.1
+3V3_IN: J1.12 Q2.3(D)
+3V3S: C11.2 C30.2 D5.2 D6.2 D7.2 D8.2 D9.2 L4.1 Q5.3(D) U2.23(BAT_IN) U8.1(CPVDD)
+5V: C1.1 C5.2 C9.2 C19.2 C20.2 C23.2 D1.1(K) J6.2 Q1.2(S) Q7.2(S) R1.1 R2.1 R3.1 R8.1 R34.2 R48.1 U3.5(VCC) U4.4(RST) U4.8(VDD) U5.3(VDD) U6.5(V)
+5V_IN: J1.11 Q1.3(D)
+5VS: C10.2 C36.2 C37.2 C45.2 L3.1 Q7.3(D) R31.2 U1.18(AVDD) U1.28(VDD) U7.5(CS#/CLK0) U7.7(VIO) U7.9(RXP/FMT0) U7.19(VDD) U7.20(NC/MDAT) U7.23(NC/EMPH#) U7.24(NC/BLSM) U7.28(MODE) U17.3(WP) U17.7(HOLD) U17.8(VCC)
+6V: C3.1 C7.2 D3.1(K) Q3.2(S) Q12.2(S) R46.1 U16.5(V+)
+6V_IN: J1.14 Q3.3(D)
+6VS: L5.1 Q12.3(D)
+A6V: C31.1 C32.1 C38.1 C41.1 L5.2 R30.2 SW1.1 U9.16(VDD) U10.4(VCC+) U11.8(V+) U12.16(VDD) U13.8(V+) U18.5(+V)
+DVDD: C27.2 D10.2 D11.2 L4.2 U8.8(AVDD) U8.20(DVDD)
-6V: C4.2 C8.2 D4.2(A) Q4.2(S) Q13.3(S) R47.1 U16.2(V-)
-6V_IN: J1.13 Q4.3(D)
-6VS: L6.1 Q13.2(D) Q13.4(D)
-A6V: C29.2 C35.2 C39.2 C40.2 L6.2 U9.7(VEE) U10.11(VCC-) U11.4(V-) U12.7(VEE) U13.4(V-)
AGND: C29.1 C31.2 C32.2 C35.1 C38.2 C39.1 C40.1 C41.2 C43.2 J2.1 L1.2 R15.1 R16.1 R39.2 R41.1 R42.1 R44.2 U9.3(cy) U9.5(CX) U9.6(INH) U9.8(VSS) U9.9(C) U10.3(+INA) U10.5(+INB) U10.10(+INC) U10.12(+IND) U11.3(IN1+) U11.5(IN2+) U12.1(by) U12.3(cy) U12.5(CX) U12.6(INH) U12.8(VSS) U12.9(C) U12.13(ay) U14.4(VSS) U18.2(-V)
DGND: C27.1 C33.1 L2.2 U8.3(CPGND) U8.9(AGND) U8.10(DEMP) U8.16(FMT) U8.19(DGND)
GND: C1.2 C2.2 C3.2 C4.1 C5.1 C6.1 C7.1 C8.1 C9.1 C10.1 C11.1 C12.1 C13.1 C14.1 C15.1 C17.1 C18.2 C19.1 C20.1 C21.2 C22.1 C23.1 C25.1 C30.1 C36.1 C37.1 C45.1 D1.2(A) D2.2(A) D3.2(A) D4.1(K) J1.15 J1.16 J6.6 L1.1 L2.1 Q1.1(G) Q2.1(G) Q3.1(G) Q4.1(G) Q6.2(S) Q8.2(S) Q9.2(S) Q10.2(S) Q11.2(S) R4.2 R9.2 R32.1 R33.1 R49.2 U1.19(GND) U1.29(GND) U2.16(GND) U2.50(GND) U3.3(GND) U4.1(GND) U5.2(VSS) U6.3(G) U7.1(NC/CSS) U7.2(CDOUT/COPY/C) U7.3(CCLK/L) U7.4(CDIN/CLK1) U7.8(DGND) U7.10(NC/FMT1) U7.14(NC/M/S#) U7.16(DGND) U7.21(NC/MONO) U7.22(INT#/AUDIO#) U7.26(NC/V) U7.27(U) U17.4(VSS)
+BVDD: C43.1 L3.2 R37.2 R38.2 R40.1 R43.1 U14.11(WP#) U14.12(SHDN#) U14.14(VDD)
/AI_RX: Q9.1(G) U3.4(Y)
AI_RX: R1.2 U1.5(PA7) U1.31(PA1) U3.2(A) U4.2(TRIG) U5.4(RXD)
AI_TX: R2.2 U1.30(PA0(EXTCLK)) U5.1(TXD)
AIBUS+: J1.10 U5.7(CANH)
AIBUS-: J1.9 U5.6(CANL)
AIBUS_L+: J1.2 U9.14(ax or ay)
AIBUS_L-: J1.1 U12.14(ax or ay)
AIBUS_R+: J1.4 U9.15(bx ro by)
AIBUS_R-: J1.3 U12.15(bx ro by)
ANALOG_BIAS_L: C26.1 R15.2 R37.1 U13.3(IN1+)
ANALOG_BIAS_R: C28.1 R16.2 R38.1 U13.5(IN2+)
ANALOG_OUT_L: C34.1 R17.1 R26.1 R41.2
ANALOG_OUT_L+: R20.2 U9.12(ax) U10.14(OUTD)
ANALOG_OUT_L-: R18.2 R19.1 U10.1(OUTA) U12.12(ax)
ANALOG_OUT_R: C42.1 R21.1 R27.1 R42.2
ANALOG_OUT_R+: R24.2 U9.2(bx) U10.8(OUTC)
ANALOG_OUT_R-: R22.2 R23.1 U10.7(OUTB) U12.2(bx)
ANALOG_PRE_L: C34.2 U14.6(P1W)
ANALOG_PRE_R: C42.2 U14.9(P0W)
BIAS_CS: U1.16(PD6) U14.1(CS#)
BM83_MFB: R13.2 U1.10(PD0)
BM83_MODE: R10.2 U1.11(PD1)
BM83_RESET: R14.2 U1.12(PD2)
BM83_RX: R11.2 U1.7(PC1)
BM83_TX: R12.2 U1.6(PC0)
CLK: U1.4(PA6) U14.2(SCK) U17.6(SCK)
DAC_FILTER_MODE: D11.1 R36.1 U8.11(FLT)
DAC_MUTE: D10.1 R35.1 U8.17(XSMT)
DIGITAL_MODE: J1.6 Q10.3(D) R34.1
DIGITAL_OUT: Q10.1(G) R33.2 U1.9(PC3) U18.1(+IN)
DIGITAL_OUT_6V: R30.1 U9.10(B) U9.11(A) U12.10(B) U12.11(A) U18.4(OUT)
EEPROM_CS: U1.17(PD7) U17.1(CS)
FULL_POWER_ON: Q6.1(G) Q8.1(G) Q11.1(G) R9.1 U6.4(Y) U16.1(+IN)
I2S_BCK: U2.3(SCLK1) U7.11(SCLK) U8.13(BCK)
I2S_DOUT: U2.4(DT1) U7.13(SDATA) U8.14(DIN)
I2S_LRCK: U2.2(RFS1) U7.12(SYNC) U8.15(LRCK)
I2S_MCLK: U2.5(MCLK1) U7.6(MCLK) U8.12(SCK)
MIC+: C16.2 U2.14(MICP1)
MIC-: C17.2 U2.13(MICN1)
MIC_IN: C16.1 C18.1 C44.1 R7.1
MIC_IN_PWR: C44.2 J2.2 R45.1
PHONE+: J1.8 R29.2 U11.7(OUT2)
PHONE-: J1.7 R25.2 R28.1 U11.1(OUT1)
PICO: U1.3(PA5) U14.13(SDO) U17.2(SO)
POCI: U1.2(PA4) U14.3(SDI) U17.5(SI)
POWER_ON: U1.8(PC2) U6.1(A)
POWER_PULSE: U4.3(OUT) U6.2(B)
PRE_OUT_L: C26.2 U8.6(OUTL)
PRE_OUT_R: C28.2 U8.7(OUTR)
PROG_RX: J6.4 U1.21(PF1(TOSC2))
PROG_TX: J6.5 U1.20(PF0(TOSC1))
PROG_UPDI: J6.1 U1.27(UPDI)
SPDIF_OUT+: U7.18(TX+) U9.13(ay)
SPDIF_OUT-: U7.17(TX-) U9.1(by)
SPDIF_RST: U1.13(PD3) U7.15(RST#)
Net-(C12-2): C12.2 U2.25(VDD_IO)
Net-(C13-2): C13.2 U2.24(SYS_PWR)
Net-(C14-2): C14.2 R6.2 U2.15(MICBIAS)
Net-(C15-2): C15.2 R6.1 R7.2
Net-(C21-1): C21.1 Q9.3(D) R8.2 U4.6(THR) U4.7(DIS)
Net-(C22-2): C22.2 U4.5(C/V)
Net-(C24-1): C24.1 U8.4(CAPM)
Net-(C24-2): C24.2 U8.2(CAPP)
Net-(C25-2): C25.2 U8.5(VNEG)
Net-(C33-2): C33.2 U8.18(LDOO)
Net-(D5-1): D5.1 R10.1 U2.31(P3_4/UART_RTS)
Net-(D6-1): D6.1 R11.1 U2.30(P8_5/UART_TXD)
Net-(D7-1): D7.1 R12.1 U2.29(P8_6/UART_RXD)
Net-(D8-1): D8.1 R13.1 U2.26(PWR(MFB))
Net-(D9-1): D9.1 R14.1 U2.43(RST_N)
Net-(Q5-1): Q5.1(G) Q6.3(D) R5.2
Net-(Q7-1): Q7.1(G) Q8.3(D) R3.2
Net-(Q11-3): Q11.3(D) Q12.1(G) R46.2
Net-(Q13-1): Q13.1(G) R47.2 U16.4(OUT)
Net-(R4-1): R4.1 U5.8(RS)
Net-(R17-2): R17.2 R18.1 U10.2(-INA)
Net-(R19-2): R19.2 R20.1 U10.13(-IND)
Net-(R21-2): R21.2 R22.1 U10.6(-INB)
Net-(R23-2): R23.2 R24.1 U10.9(-INC)
Net-(R25-1): R25.1 R26.2 R27.2 U11.2(IN1-)
Net-(R28-2): R28.2 R29.1 U11.6(IN2-)
Net-(R31-1): R31.1 R32.2 U18.3(-IN)
Net-(R35-2): R35.2 U1.14(PD4)
Net-(R36-2): R36.2 U1.15(PD5)
Net-(R39-1): R39.1 R40.2 U14.5(P1B)
Net-(R43-2): R43.2 R44.1 U14.10(P0B)
Net-(R45-2): R45.2 SW1.2
Net-(U13.1-1): U13.1(OUT1) U13.2(IN1-) U14.7(P1A)
Net-(U13.2-6): U13.6(IN2-) U13.7(OUT2) U14.8(P0A)

Not connected (* = marked no-connect by the designer): J1 5*; J2 3*; J6 3*; U1 1(PA3)* 22(PF2)* 23(PF3)* 24(PF4)* 25(PF5)* 26(PF6)* 32(PA2)*; U2 1(DR1)* 6(AOHPR)* 7(AOHPM)* 8(AOHPL)* 9(MICN2)* 10(MICP2)* 11(AIR)* 12(AIL)* 17(DMIC_CLK)* 18(DMIC1_R)* 19(DMIC1_L)* 20(P3_2)* 21(P2_6)* 22(ADAP_IN)* 27(SKI1_AMB_DET)* 28(SK2_KEY_AD)* 32(LED1)* 33(P0_2)* 34(LED2)* 35(P0_6)* 36(DM)* 37(DP)* 38(P0_3)* 39(P2_7)* 40(P0_5)* 41(P1_6/PWM1)* 42(P2_3)* 44(P0_1)* 45(P0_7)* 46(P1_2/TDI_CPU/SCL)* 47(P1_3/TCK_CPU/SDA)* 48(P3_7/UART_CTS)* 49(P0_0/UART_TX_IND)*; U3 1(NC)*; U5 5(VREF)*; U7 25(BLS)*; U9 4(CX OR CY)*; U12 4(CX OR CY)*
